# EasyEDA Pro project ProDoc_Small size safemrc_2025-09-04.epro, schematic Schematic1_1

## Sheets
1 STM32_core: Board Name: Small size safemrc; Create Date: 2025-07-28; Page Name: STM32_core; Project Name: RMRB_with_current_sensor; Schematic Name: Schematic1_1; Update Date: 2025-09-03; Company: 嘉立创EDA; Page Size: A4; Version: V1.0
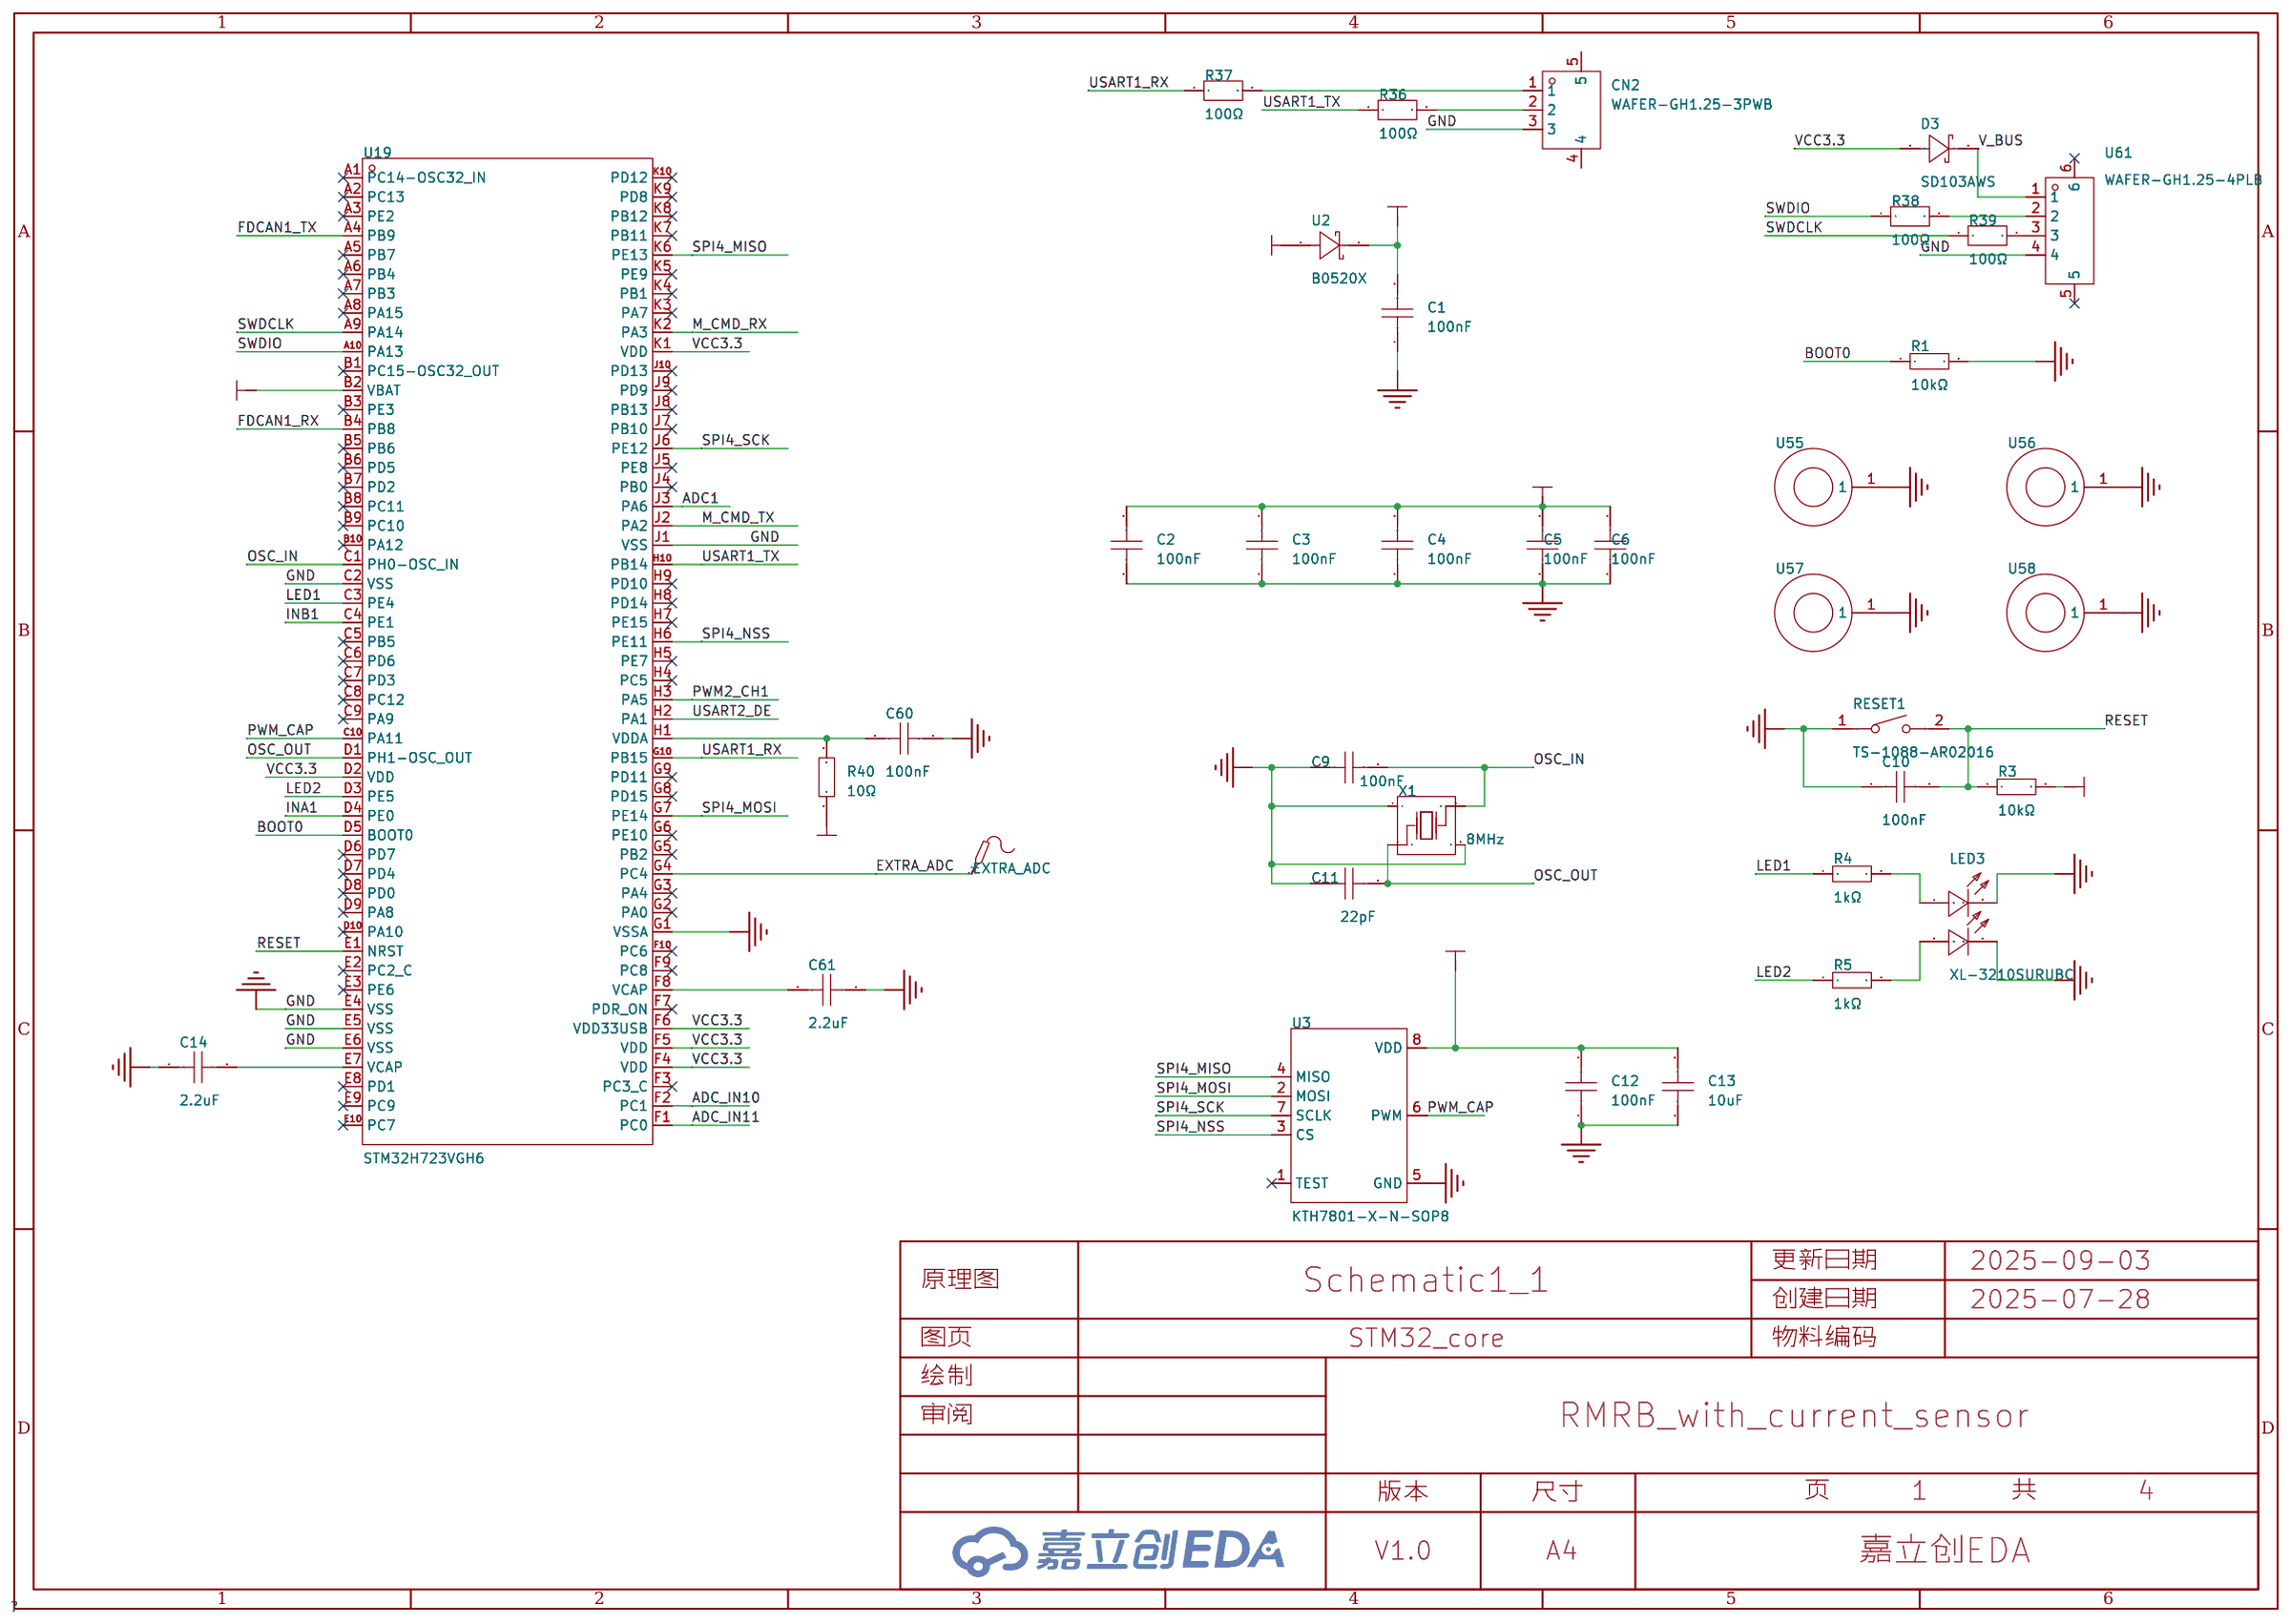
[diagram p0: STM32_core]
2 Power &amp; Com: Page Name: Power &amp; Com; Update Date: 2025-09-02
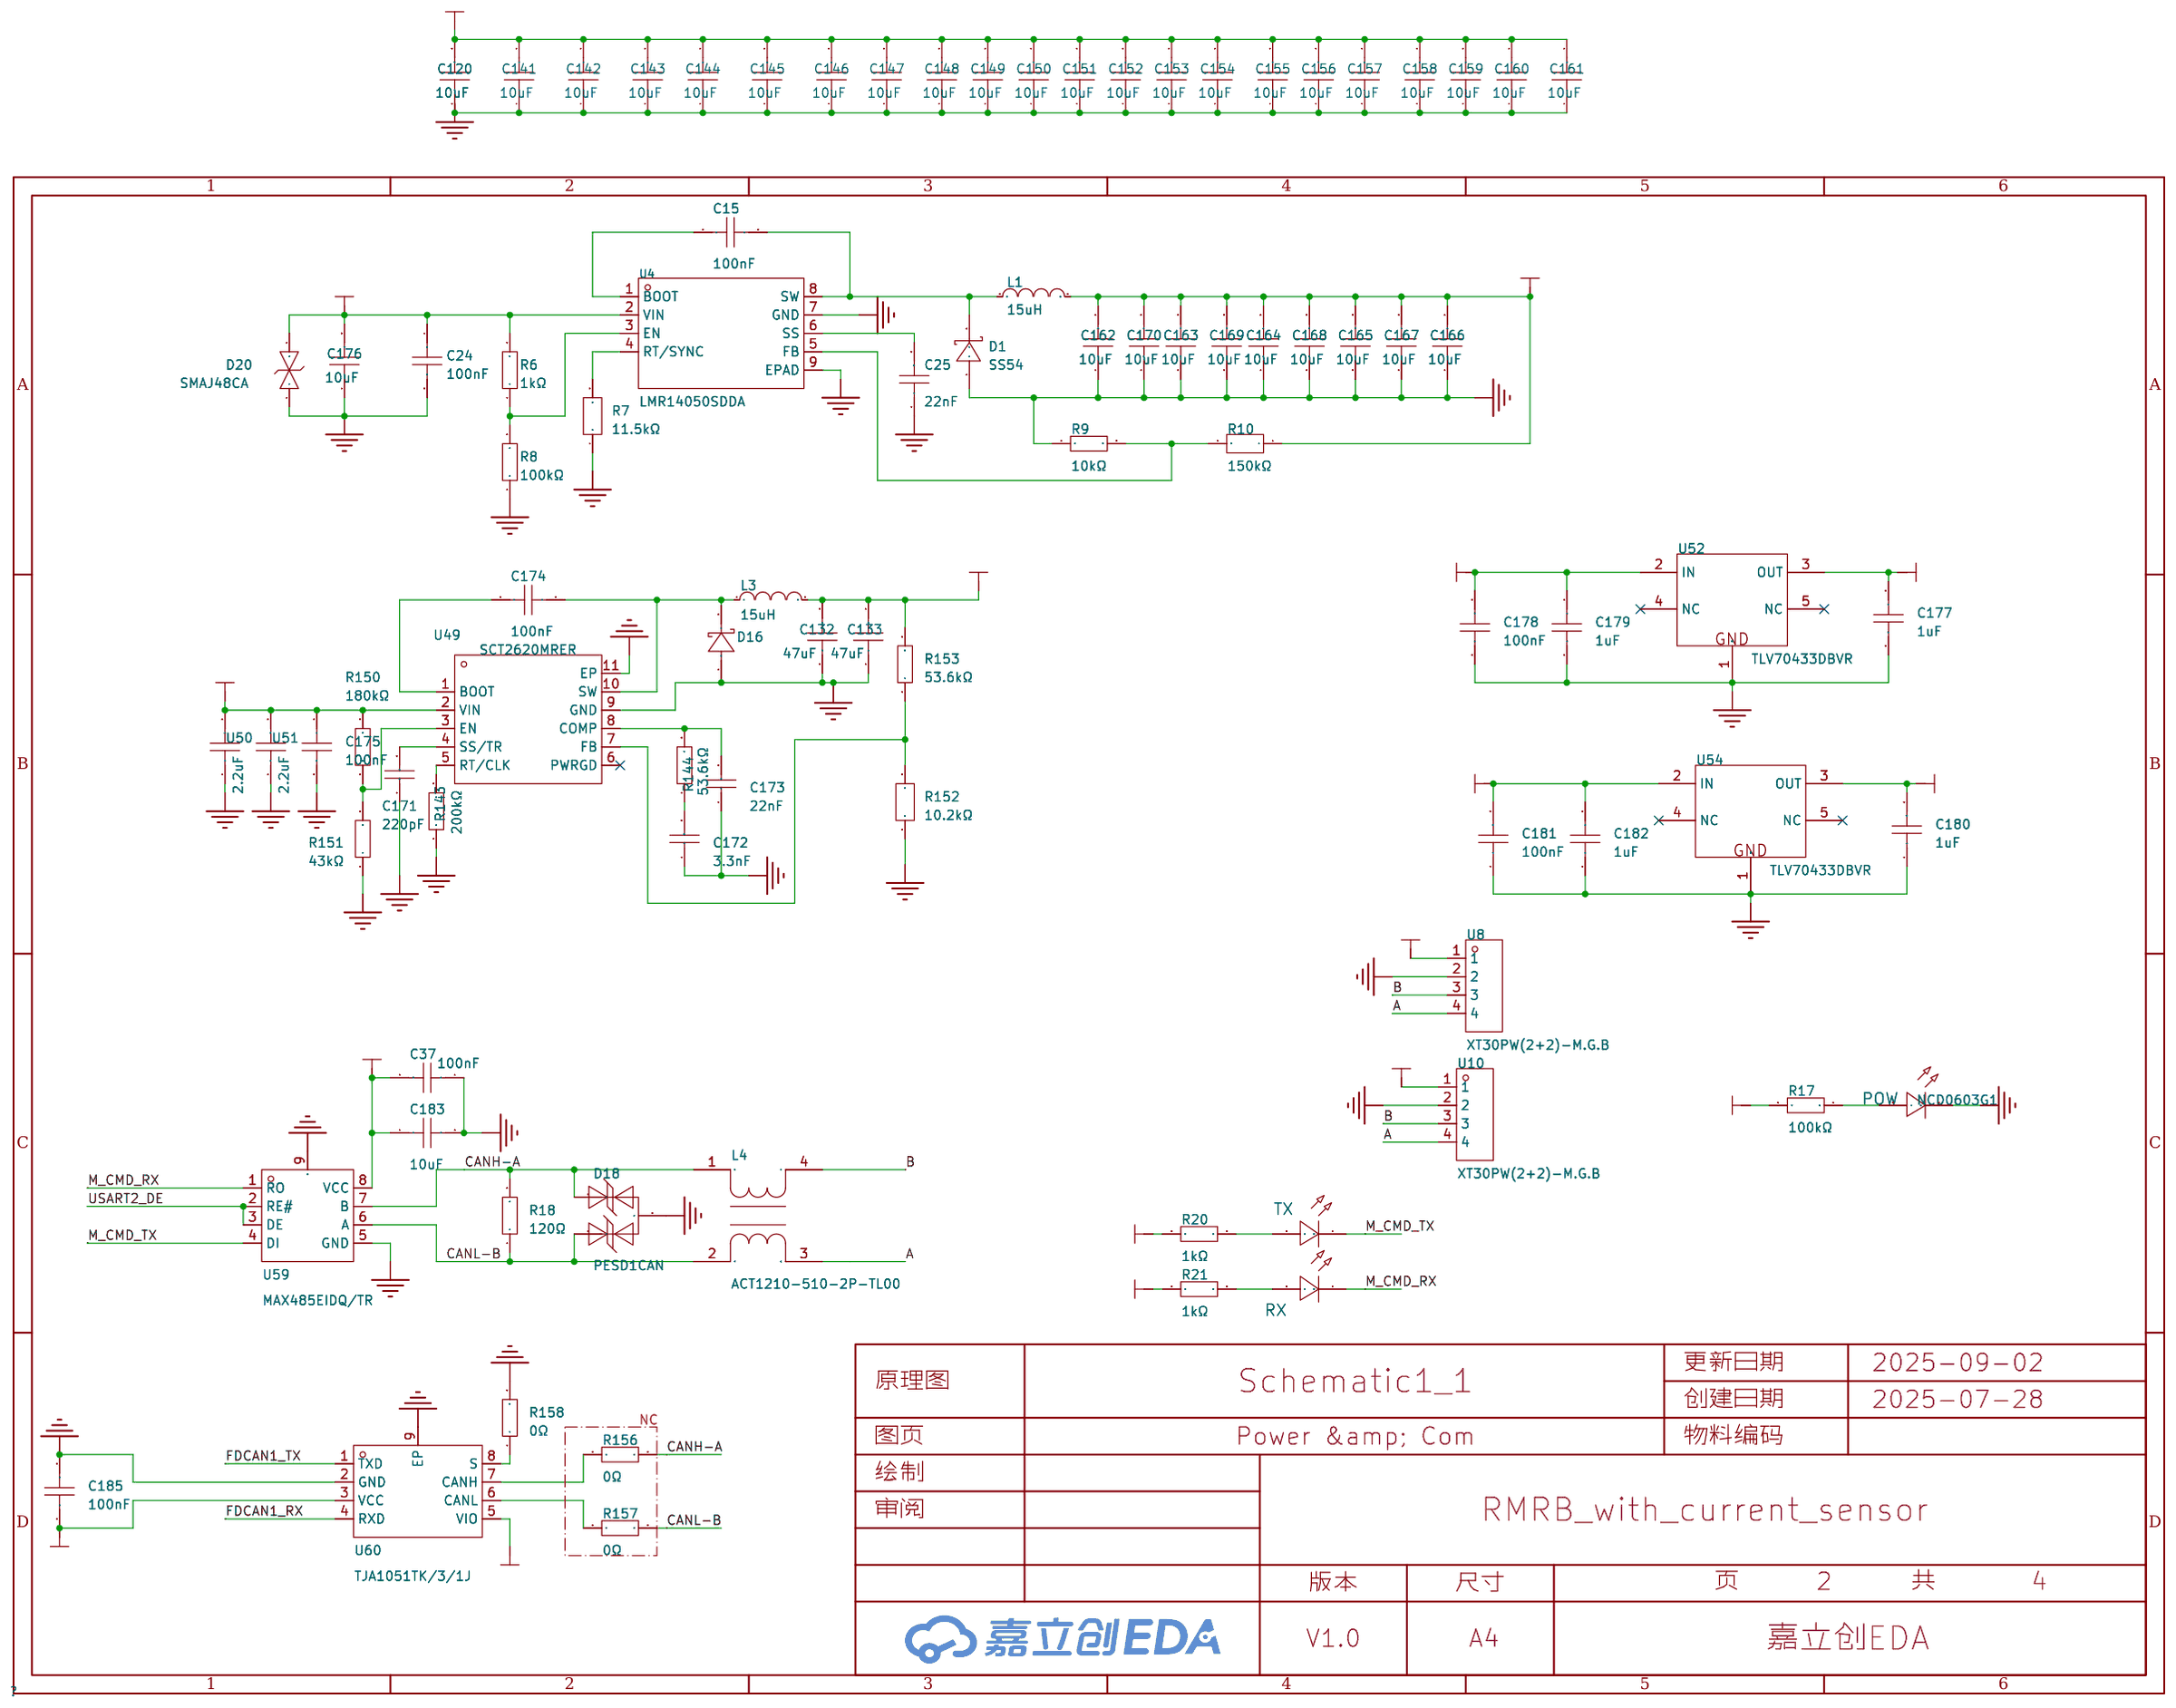
[diagram p1: Power &amp; Com]
3 H-bridge: Page Name: H-bridge; Update Date: 2025-08-11
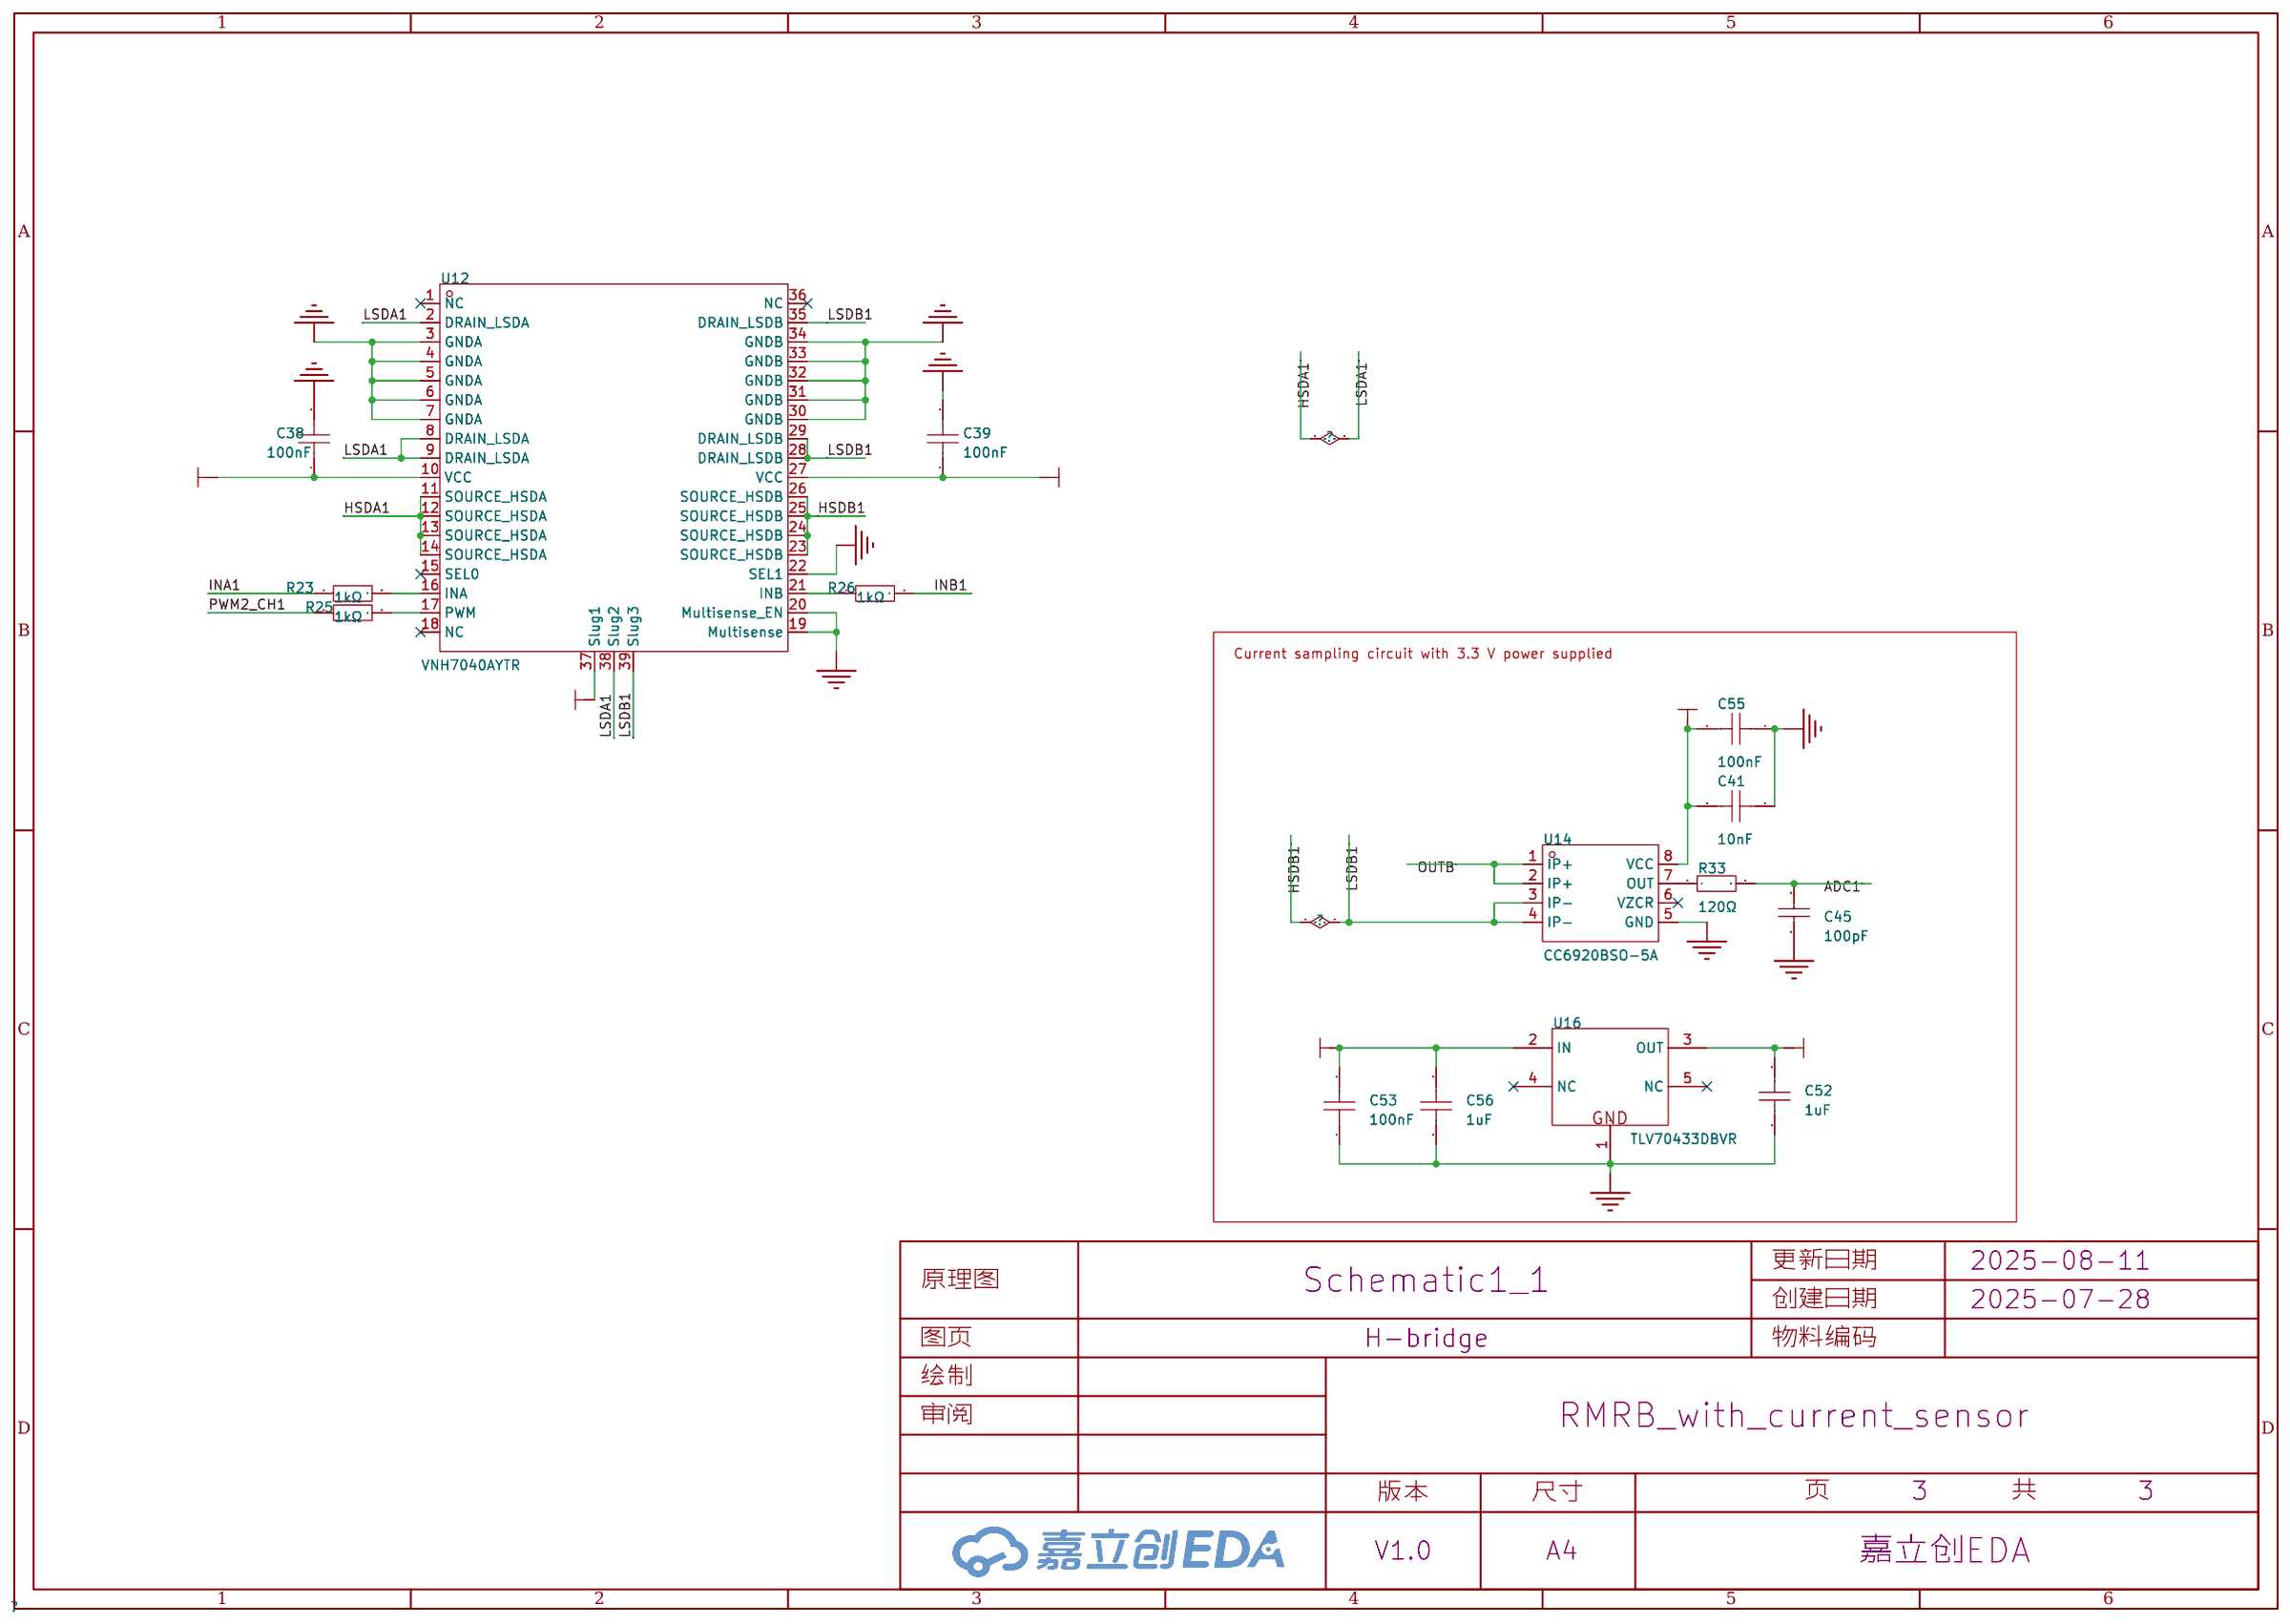
[diagram p2: H-bridge]
4 extensive adc: Create Date: 2025-09-03; Page Name: extensive adc
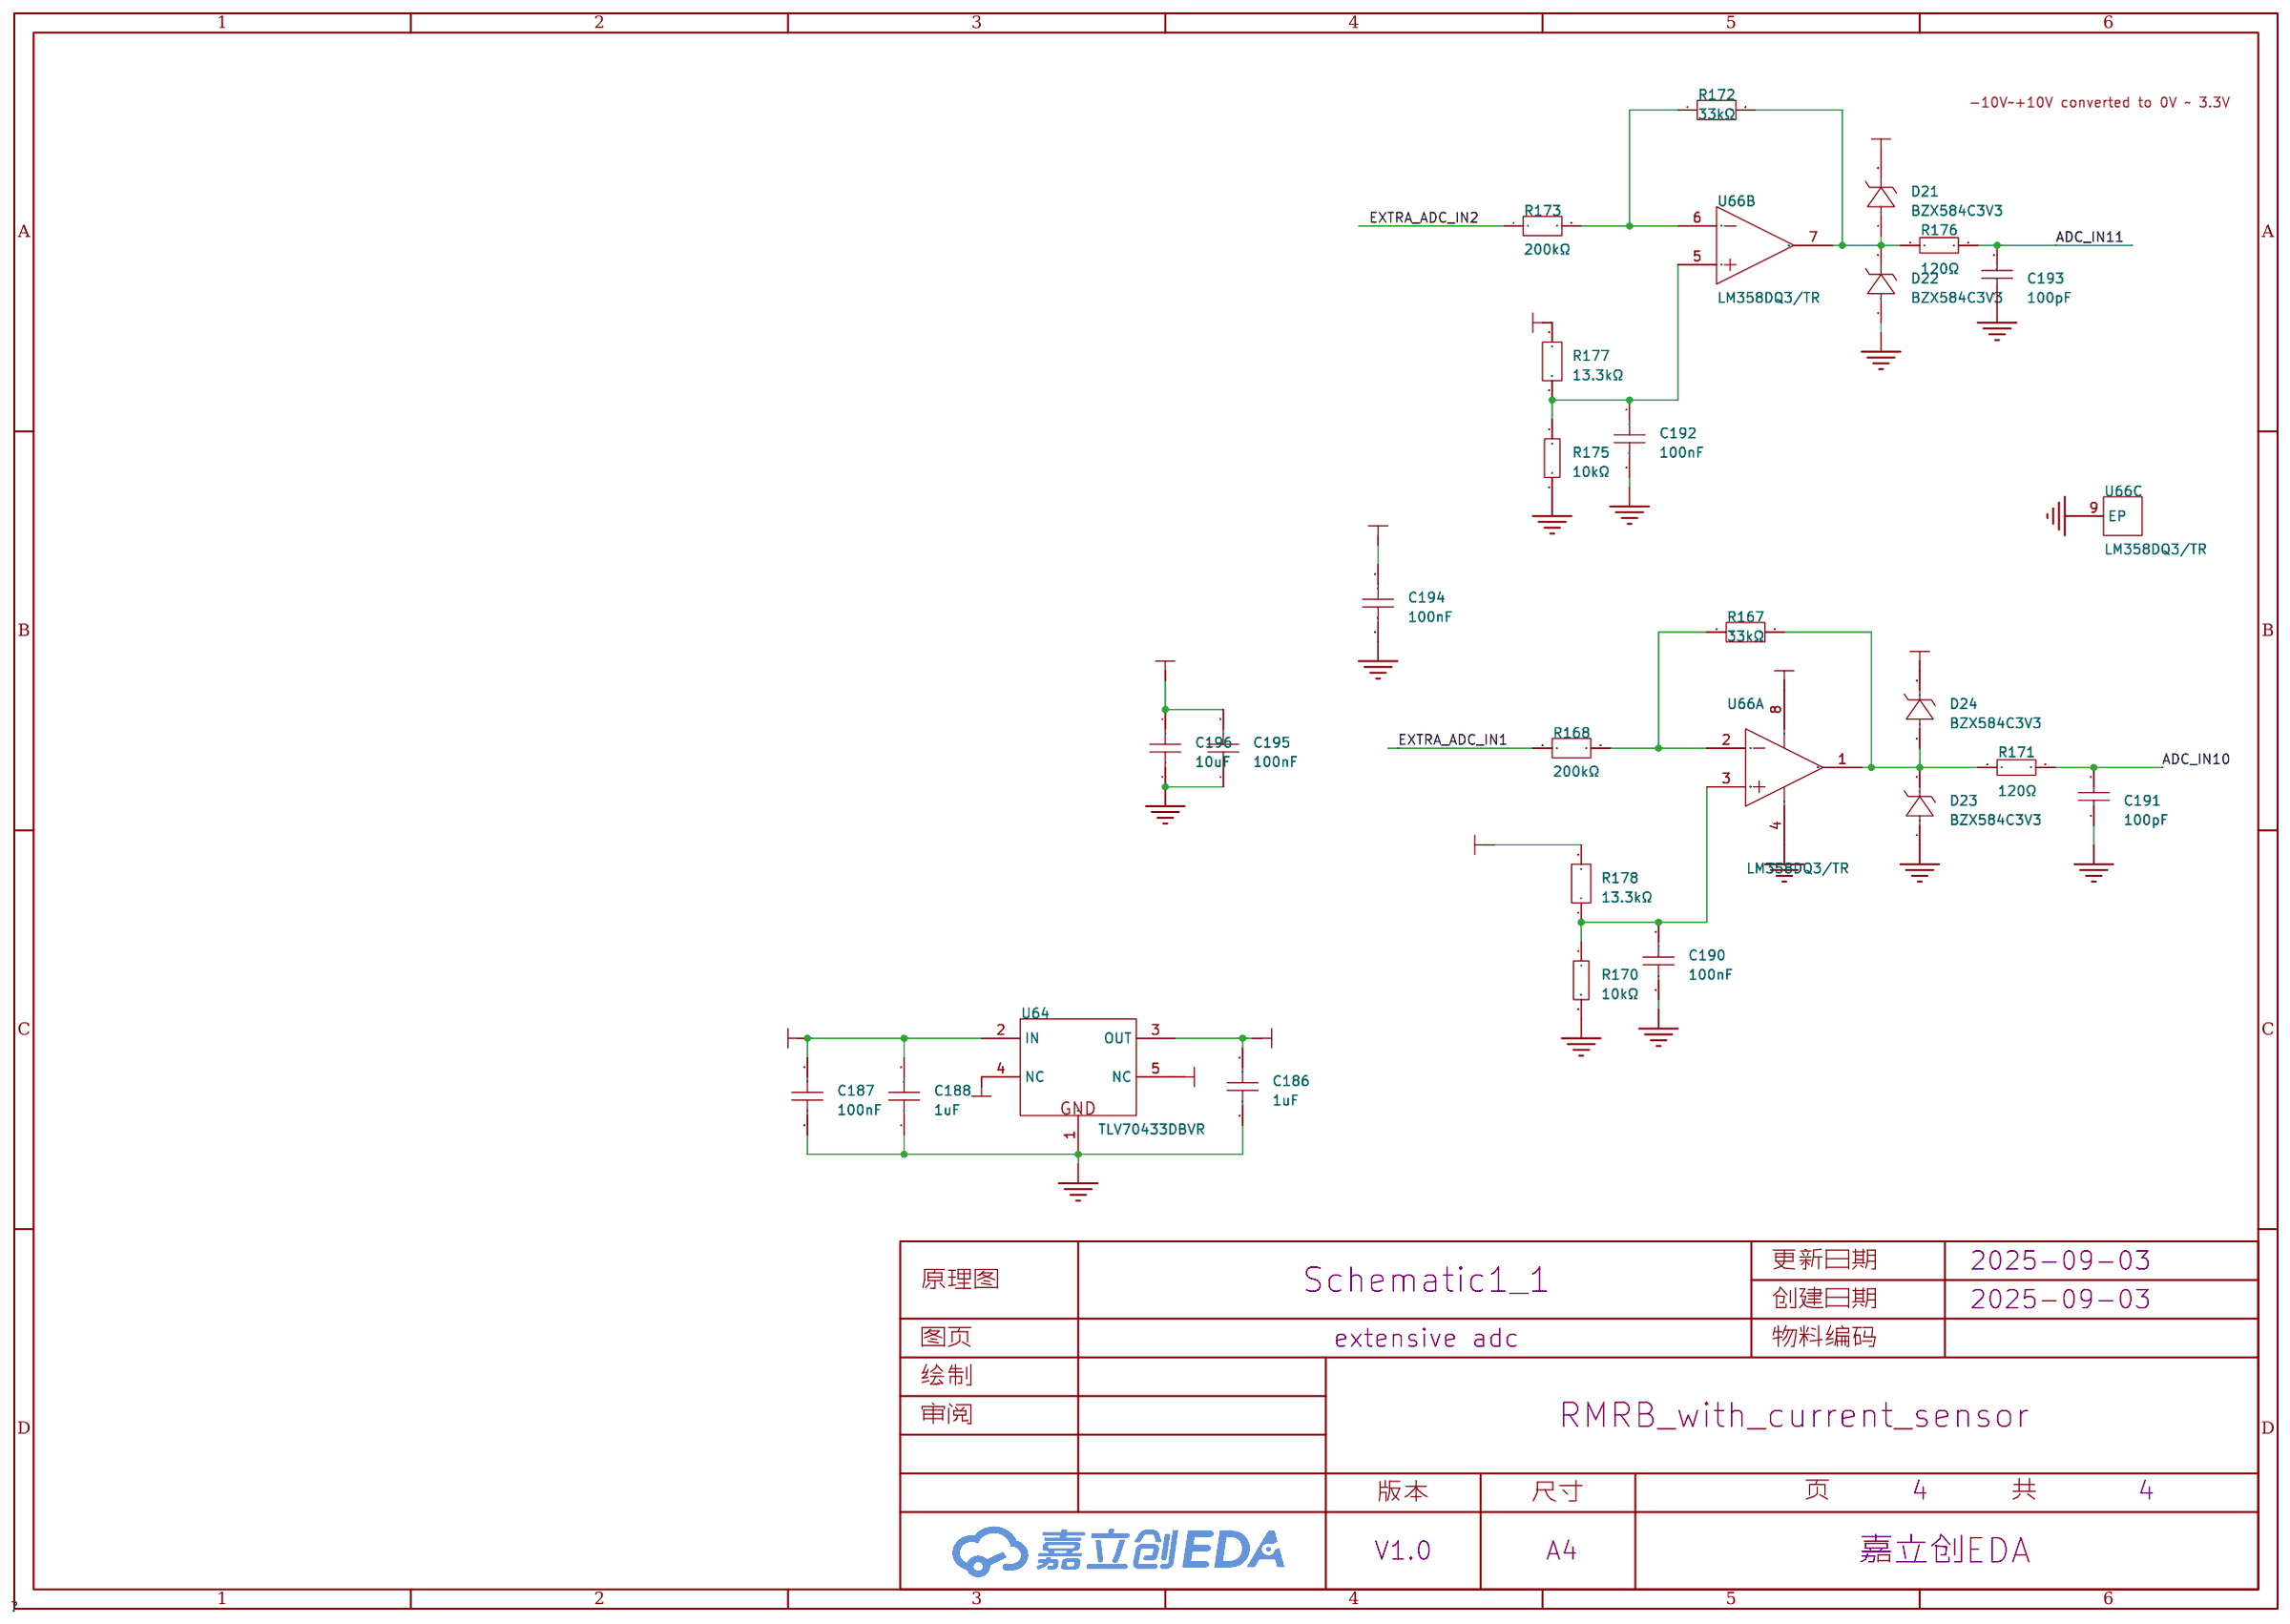
[diagram p3: extensive adc]

## Parts
sheet extensive adc
C186  1uF  [C0402]
C187  100nF  [C0402]
C188  1uF  [C0402]
C190  100nF  [C0402]
C191  100pF  [C0402]
C192  100nF  [C0402]
C193  100pF  [C0402]
C194  100nF  [C0402]
C195  100nF  [C0402]
C196  10uF  [C0402]
D21  BZX584C3V3  [SOD-523_L1.2-W0.8-LS1.6-FD]
D22  BZX584C3V3  [SOD-523_L1.2-W0.8-LS1.6-FD]
D23  BZX584C3V3  [SOD-523_L1.2-W0.8-LS1.6-FD]
D24  BZX584C3V3  [SOD-523_L1.2-W0.8-LS1.6-FD]
R167  33kΩ  [R0402]
R168  200kΩ  [R0402]
R170  10kΩ  [R0402]
R171  120Ω  [R0402]
R172  33kΩ  [R0402]
R173  200kΩ  [R0402]
R175  10kΩ  [R0402]
R176  120Ω  [R0402]
R177  13.3kΩ  [R0402]
R178  13.3kΩ  [R0402]
U64  TLV70433DBVR  [SOT-23-5_L3.0-W1.7-P0.95-LS2.8-BR]
U66  LM358DQ3/TR  [DFN-8_L3.0-W3.0-P0.65-BL-EP-2]  (sections 1,2,3)
sheet H-bridge
C38  100nF  [C0402]
C39  100nF  [C0402]
C41  10nF  [C0402]
C45  100pF  [C0402]
C52  1uF  [C0402]
C53  100nF  [C0402]
C55  100nF  [C0402]
C56  1uF  [C0402]
R23  1kΩ  [R0402]
R25  1kΩ  [R0402]
R26  1kΩ  [R0402]
R33  120Ω  [R0402]
U12  VNH7040AYTR  [POWERSSO-36_L10.3-W7.5-P0.50-LS10.3-BL-EP_VNH7070AYTR]
U14  CC6920BSO-5A  [SOP-8_L4.9-W3.9-P1.27-LS6.0-BL]
U16  TLV70433DBVR  [SOT-23-5_L3.0-W1.7-P0.95-LS2.8-BR]
sheet Power &amp; Com
C15  100nF  [C0402]
C24  100nF  [C0402]
C25  22nF  [C0402]
C37  100nF  [C0402]
C120  10uF  [C0805]
C132  47uF  [C0805]
C133  47uF  [C0805]
C141  10uF  [C0805]
C142  10uF  [C0805]
C143  10uF  [C0805]
C144  10uF  [C0805]
C145  10uF  [C0805]
C146  10uF  [C0805]
C147  10uF  [C0805]
C148  10uF  [C0805]
C149  10uF  [C0805]
C150  10uF  [C0805]
C151  10uF  [C0805]
C152  10uF  [C0805]
C153  10uF  [C0805]
C154  10uF  [C0805]
C155  10uF  [C0805]
C156  10uF  [C0805]
C157  10uF  [C0805]
C158  10uF  [C0805]
C159  10uF  [C0805]
C160  10uF  [C0805]
C161  10uF  [C0805]
C162  10uF  [C0805]
C163  10uF  [C0805]
C164  10uF  [C0805]
C165  10uF  [C0805]
C166  10uF  [C0805]
C167  10uF  [C0805]
C168  10uF  [C0805]
C169  10uF  [C0805]
C170  10uF  [C0805]
C171  220pF  [C0402]
C172  3.3nF  [C0402]
C173  22nF  [C0402]
C174  100nF  [C0402]
C175  100nF  [C0402]
C176  10uF  [C0805]
C177  1uF  [C0402]
C178  100nF  [C0402]
C179  1uF  [C0402]
C180  1uF  [C0402]
C181  100nF  [C0402]
C182  1uF  [C0402]
C183  10uF  [C0402]
C185  100nF  [C0201]
D1  SS54  [SMA_L4.4-W2.8-LS5.4-R-RD]
D16  B5819WS  [SOD-323_L1.7-W1.3-LS2.5-FD]
D18  PESD1CAN  [SOT-23-3_L2.9-W1.6-P1.90-LS2.8-BR]
D20  SMAJ48CA  [SMA_L4.4-W2.8-LS5.1-BI]
L1  15uH  [IND-SMD_L7.0-W6.6_FXL0630]
L3  15uH  [IND-SMD_L4.0-W4.0]
L4  ACT1210-510-2P-TL00  [FILTER-SMD_4P-L3.2-W2.5-BL_ACT1210]
POW  NCD0603G1  [LED0603-RD_1]
R6  1kΩ  [R0402]
R7  11.5kΩ  [R0402]
R8  100kΩ  [R0402]
R9  10kΩ  [R0402]
R10  150kΩ  [R0402]
R17  100kΩ  [R0402]
R18  120Ω  [R0402]
R20  1kΩ  [R0402]
R21  1kΩ  [R0402]
R143  200kΩ  [R0402]
R144  53.6kΩ  [R0402]
R150  180kΩ  [R0402]
R151  43kΩ  [R0402]
R152  10.2kΩ  [R0402]
R153  53.6kΩ  [R0402]
R156  0Ω  [R0402]
R157  0Ω  [R0402]
R158  0Ω  [R0402]
RX  NCD0603G1  [LED0603-RD_1]
TX  NCD0603G1  [LED0603-RD_1]
U4  LMR14050SDDA  [SOP-8_L4.9-W3.9-P1.27-LS6.0-BL-EP-2]
U8  XT30PW(2+2)-M.G.B  [CONN-TH_4P-XT30PW-M]
U10  XT30PW(2+2)-M.G.B  [CONN-TH_4P-XT30PW-M]
U49  SCT2620MRER  [MSOP-10_L3.0-W3.0-P0.50-LS5.0-BL-EP]
U50  2.2uF  [C0805]
U51  2.2uF  [C0805]
U52  TLV70433DBVR  [SOT-23-5_L3.0-W1.7-P0.95-LS2.8-BR]
U54  TLV70433DBVR  [SOT-23-5_L3.0-W1.7-P0.95-LS2.8-BR]
U59  MAX485EIDQ/TR  [DFN-8_L3.0-W3.0-P0.65-BL-EP2.45]
U60  TJA1051TK/3/1J  [HVSON-8_L3.0-W3.0-P0.65-BL-EP]
sheet STM32_core
C1  100nF  [C0402]
C2  100nF  [C0402]
C3  100nF  [C0402]
C4  100nF  [C0402]
C5  100nF  [C0402]
C6  100nF  [C0402]
C9  100nF  [C0402]
C10  100nF  [C0402]
C11  22pF  [C0402]
C12  100nF  [C0402]
C13  10uF  [C0603]
C14  2.2uF  [C0402]
C60  100nF  [C0402]
C61  2.2uF  [C0402]
CN2  WAFER-GH1.25-3PWB  [CONN-TH_3P-P1.25_GH1.25]
D3  SD103AWS  [SOD-323_L1.7-W1.3-LS2.6-RD-1]
EXTRA_ADC  -  [Test-Point-0.5mm]
LED3  XL-3210SURUBC  [LED-SMD_4P-L3.2-W1.5_LED_RGB]
R1  10kΩ  [R0402]
R3  10kΩ  [R0402]
R4  1kΩ  [R0402]
R5  1kΩ  [R0402]
R36  100Ω  [R0402]
R37  100Ω  [R0402]
R38  100Ω  [R0402]
R39  100Ω  [R0402]
R40  10Ω  [R0402]
RESET1  TS-1088-AR02016  [SW-SMD_L3.9-W3.0-P4.45]
U2  B0520X  [SOD-523_L1.2-W0.8-LS1.6-FD]
U3  KTH7801-X-N-SOP8  [SOIC-8_L4.9-W3.9-P1.27-LS6.0-BL]
U19  STM32H723VGH6  [TFBGA-100_L8.0-W8.0-R10-C10-P0.80-BL]
U55  -  [星月型焊盘]
U56  -  [星月型焊盘]
U57  -  [星月型焊盘]
U58  -  [星月型焊盘]
U61  WAFER-GH1.25-4PLB  [CONN-SMD_4P-P1.25_XUNPU_WAFER-GH1.25-4PLB]
X1  8MHz  [CRYSTAL-SMD_4P-L3.2-W2.5-BL]

## Library data of the parts
C52 C56 C177 C179 C180 C182 C186 C188 = CGA0402X5R105K500GT: 容值:1uF;精度:±10%;额定电压:50V;材质(温度系数):X5R;; LCSC Part Name: 1uF ±10% 50V; Supplier Part: C6119811; Manufacturer: HRE(芯声); Supplier Footprint: 0402; JLCPCB Part Class: 扩展库; Supplier: LCSC; Tolerance: ±10%; Voltage Rated: 50V; Temperature Coefficient: X5R
C53 C55 C178 C181 C187 C190 C192 C194 = CGA0402X7R104K160GT: 容值:100nF;精度:±10%;额定电压:16V;材质(温度系数):X7R;; LCSC Part Name: 100nF ±10% 16V; Supplier Part: C6119799; Manufacturer: HRE(芯声); Supplier Footprint: 0402; JLCPCB Part Class: 扩展库; Supplier: LCSC; Tolerance: ±10%; Voltage Rated: 16V; Temperature Coefficient: X7R
C45 C191 C193 = CC0402JRNPO9BN101: 容值:100pF;精度:±5%;额定电压:50V;材质(温度系数):NP0;; LCSC Part Name: 100pF ±5% 50V; Supplier Part: C106200; Manufacturer: YAGEO(国巨); Supplier Footprint: 0402; JLCPCB Part Class: Extended Part; Datasheet: https://atta.szlcsc.com/upload/public/pdf/source/20170505/1493957838062.pdf; Supplier: LCSC; Tolerance: ±5%; Voltage Rated: 50V; Temperature Coefficient: NP0
C1-C6 C9 C10 C12 C15 C24 C37-C39 C60 C174 C175 C195 = CC0402KRX7R9BB104: 容值:100nF;精度:±10%;额定电压:50V;材质(温度系数):X7R;; LCSC Part Name: 100nF ±10% 50V; Supplier Part: C131394; Manufacturer: YAGEO(国巨); Supplier Footprint: 0402; JLCPCB Part Class: Extended Part; Datasheet: https://atta.szlcsc.com/upload/public/pdf/source/20181008/C309510_22F155564471FAF6A489F7D68F34234E.pdf; Supplier: LCSC; Tolerance: ±10%; Voltage Rated: 50V; Temperature Coefficient: X7R
C183 C196 = CGA0402X5R106M100GT: 容值:10uF;精度:±20%;额定电压:10V;温度系数:X5R;; LCSC Part Name: 10uF ±20% 10V; Supplier Part: C6119763; Manufacturer: HRE(芯声); Supplier Footprint: 0402; JLCPCB Part Class: 扩展库; Supplier: LCSC; Tolerance: ±20%; Voltage Rating: 10V; Temperature Coefficient: X5R
D21-D24 = BZX584C3V3_C19077462: 二极管配置:独立式;稳压值(标称值):3.3V;稳压值(范围):3.1V~3.5V;耗散功率(Pd):150mW;; LCSC Part Name: 独立式 耐压:3.3V 电流:5uA@1V; Supplier Part: C19077462; Manufacturer: 宏嘉诚; Supplier Footprint: SOD-523; JLCPCB Part Class: 扩展库; Datasheet: https://item.szlcsc.com/datasheet/BZX584C3V3/20275547.html; Supplier: LCSC; Diode Configuration: 独立式; Zener Voltage(Nom): 3.3V; Reverse Leakage Current (Ir): 5uA@1V; Zener Voltage(Range): 3.1V~3.5V; Pd - Power Dissipation: 150mW; Impedance(Zzt): 95Ω; Impedance(Zzk): 600Ω; Operating Junction Temperature Range: -55℃~+150℃
R167 R172 = RT0402BRD0733KL: 电阻类型:薄膜电阻;阻值:33kΩ;精度:±0.1%;功率:62.5mW;温度系数:±25ppm/℃;; LCSC Part Name: 薄膜电阻 33kΩ ±0.1% 62.5mW; Supplier Part: C728559; Manufacturer: YAGEO(国巨); Supplier Footprint: 0402; JLCPCB Part Class: 扩展库; Datasheet: https://atta.szlcsc.com/upload/public/pdf/source/20200814/C723483_9C38DBFE9BAEFED0FBB9716EAA9FF07C.pdf; Supplier: LCSC; Type: 薄膜电阻; Tolerance: ±0.1%; Power(Watts): 62.5mW; Temperature Coefficient: ±25ppm/℃; Operating Temperature: -55℃~+155℃
R168 R173 = RT0402BRD07200KL: 电阻类型:薄膜电阻;阻值:200kΩ;精度:±0.1%;功率:62.5mW;温度系数:±25ppm/℃;; LCSC Part Name: 薄膜电阻 200kΩ ±0.1% 62.5mW; Supplier Part: C728556; Manufacturer: YAGEO(国巨); Supplier Footprint: 0402; JLCPCB Part Class: 扩展库; Datasheet: https://item.szlcsc.com/datasheet/RT0402BRD07200KL/775871.html; Supplier: LCSC; Type: 薄膜电阻; Tolerance: ±0.1%; Power(Watts): 62.5mW; Temperature Coefficient: ±25ppm/℃; Operating Temperature: -55℃~+155℃
R1 R3 R9 R170 R175 = RT0402BRD0710KL: 电阻类型:薄膜电阻;阻值:10kΩ;精度:±0.1%;功率:62.5mW;最大工作电压:50V;温度系数:±25ppm/℃;; LCSC Part Name: 薄膜电阻 10kΩ ±0.1% 62.5mW; Supplier Part: C190095; Manufacturer: YAGEO(国巨); Supplier Footprint: 0402; JLCPCB Part Class: Extended Part; Datasheet: https://atta.szlcsc.com/upload/public/pdf/source/20181009/C309664_C7CEF5A7F4D0541F96EF5E54D941D229.pdf; Supplier: LCSC; Type: 薄膜电阻; Tolerance: ±0.1%; Power(Watts): 62.5mW; Overload Voltage (Max): 50V; Temperature Coefficient: ±25ppm/℃; Operating Temperature Range: -55℃~+155℃
R18 R33 R171 R176 = 0402WGF1200TCE: 电阻类型:厚膜电阻;阻值:120Ω;精度:±1%;功率:62.5mW;最大工作电压:50V;温度系数:±100ppm/℃;; LCSC Part Name: 120Ω ±1% 62.5mW 厚膜电阻; Supplier Part: C25079; Manufacturer: UNI-ROYAL(厚声); Supplier Footprint: 0402; JLCPCB Part Class: Basic Part; Datasheet: https://atta.szlcsc.com/upload/public/pdf/source/20200306/C422600_1E6D84923E4A46A82E41ADD87F860B5C.pdf; Supplier: LCSC; Type: 厚膜电阻; Tolerance: ±1%; Power(Watts): 62.5mW; Overload Voltage (Max): 50V; Temperature Coefficient: ±100ppm/℃; Operating Temperature Range: -55℃~+155℃
R177 R178 = RT0402BRD0713K3L: 电阻类型:薄膜电阻;阻值:13.3kΩ;精度:±0.1%;功率:63mW;温度系数:±25ppm/℃;; LCSC Part Name: 薄膜电阻 13.3kΩ ±0.1% 63mW; Supplier Part: C852521; Manufacturer: YAGEO(国巨); Supplier Footprint: 0402; JLCPCB Part Class: 扩展库; Datasheet: https://atta.szlcsc.com/upload/public/pdf/source/20250609/0E6D5617EADA80FA3B707391883DF2D5.pdf; Supplier: LCSC; Type: 薄膜电阻; Tolerance: ±0.1%; Power(Watts): 63mW; Temperature Coefficient: ±25ppm/℃; Operating Temperature: -55℃~+155℃
U16 U52 U54 U64 = TLV70433DBVR: 输出类型:固定;最大输入电压:24V;输出电压:3.3V;输出电流:150mA;电源纹波抑制比(PSRR):60dB@(100kHz);输出极性:正极;; LCSC Part Name: 150mA、24V、超低 IQ、低压降稳压器; Supplier Part: C94917; Manufacturer: TI(德州仪器); Supplier Footprint: SOT-23-5; JLCPCB Part Class: 扩展库; Datasheet: https://www.ti.com/cn/lit/gpn/tlv704; Supplier: LCSC; Output Type: 固定; Maximum Input Voltage: 24V; Output Voltage: 3.3V; Output Current: 150mA; Power Supply Rejection Ratio (PSRR): 60dB@(100kHz); Dropout Voltage: 1.1V@(100mA); standby current: 4.5uA; Feature: 防静电保护；过流保护(OCP)；带使能；防倒灌; Operating Temperature: -40℃~+125℃@(Tj); Output Polarity: 正极; Number of Outputs: 1
U66 = LM358DQ3/TR: 放大器数:双路;增益带宽积(GBP):1.2MHz;输入失调电压(Vos):3mV;输入偏置电流(Ib):50nA;; LCSC Part Name: 双路低功耗差分式运算放大器，单/双电源供电; Supplier Part: C46635753; Manufacturer: HGSEMI(华冠); Supplier Footprint: DFN-8-EP(3x3); Datasheet: https://item.szlcsc.com/datasheet/LM358DQ3%252FTR/48791623.html; Supplier: LCSC; Number of Channels: 双路; Maximum Power Supply Range (Vdd-Vss): 36V; Gain Bandwidth Product: 1.2MHz; Vos - Input Offset Voltage: 3mV; Ib - Input Bias Current: 50nA; Input Offset Current(Ios): 50nA; Common Mode Rejection Ratio(CMRR): 80dB; Quiescent Current: 500uA; Output Current: 24mA; Operating Temperature: 0℃~+70℃; Single supply: 3V~36V; Dual Supply: -18V~18V
C41 = CC0402KRX7R9BB103: 容值:10nF;精度:±10%;额定电压:50V;材质(温度系数):X7R;; LCSC Part Name: 10nF ±10% 50V; Supplier Part: C60133; Manufacturer: YAGEO(国巨); Supplier Footprint: 0402; JLCPCB Part Class: Extended Part; Datasheet: https://atta.szlcsc.com/upload/public/pdf/source/20180224/C181747_15194369449651363981.pdf; Supplier: LCSC; Tolerance: ±10%; Voltage Rated: 50V; Temperature Coefficient: X7R
R4-R6 R20 R21 R23 R25 R26 = 0402WGF1001TCE: 电阻类型:厚膜电阻;阻值:1kΩ;精度:±1%;功率:62.5mW;最大工作电压:50V;温度系数:±100ppm/℃;; LCSC Part Name: 1kΩ ±1% 62.5mW 厚膜电阻; Supplier Part: C11702; Manufacturer: UNI-ROYAL(厚声); Supplier Footprint: 0402; JLCPCB Part Class: Basic Part; Datasheet: https://atta.szlcsc.com/upload/public/pdf/source/20200306/C422600_1E6D84923E4A46A82E41ADD87F860B5C.pdf; Supplier: LCSC; Type: 厚膜电阻; Tolerance: ±1%; Power(Watts): 62.5mW; Overload Voltage (Max): 50V; Temperature Coefficient: ±100ppm/℃; Operating Temperature Range: -55℃~+155℃
U12 = VNH7040AYTR: 汽车级全集成H桥电机驱动; Supplier Part: C2969764; Manufacturer: ST(意法半导体); Supplier Footprint: BFSOP-36-Power; Datasheet: https://atta.szlcsc.com/upload/public/pdf/source/20230906/FCBD933B3874E79041B74CBFD9E65DE7.pdf; Supplier: LCSC
U14 = CC6920BSO-5A: 电流测量范围:-5A~5A;隔离耐压:3500Vrms;灵敏度:264mV/A;; Supplier Part: C2880430; Manufacturer: CrossChip(成都芯进); Supplier Footprint: SOP-8; JLCPCB Part Class: 扩展库; Datasheet: https://atta.szlcsc.com/upload/public/pdf/source/20241128/C0E6ECA7AE7321445B7BA60B45AD2C20.pdf; Supplier: LCSC; Current Range: -5A~5A; Supply Voltage: 3.3V; Isolated Voltage Withstand: 3500Vrms; Sensitivity: 264mV/A; Standby Current: 20mA; Operating Temperature: -40℃~+125℃
C25 C173 = CC0402KRX7R9BB223: 容值:22nF;精度:±10%;额定电压:50V;材质(温度系数):X7R;; LCSC Part Name: 22nF ±10% 50V; Supplier Part: C107026; Manufacturer: YAGEO(国巨); Supplier Footprint: 0402; JLCPCB Part Class: Extended Part; Datasheet: https://atta.szlcsc.com/upload/public/pdf/source/20170914/C128857_1505359892143968080.pdf; Supplier: LCSC; Tolerance: ±10%; Voltage Rated: 50V; Temperature Coefficient: X7R
C120 C141-C170 C176 = GRM21BR61H106KE43L: 容值:10uF;精度:±10%;额定电压:50V;材质(温度系数):X5R;; LCSC Part Name: 10uF ±10% 50V; Supplier Part: C440198; Manufacturer: muRata(村田); Supplier Footprint: 0805; JLCPCB Part Class: 基础库; Datasheet: https://atta.szlcsc.com/upload/public/pdf/source/20230811/95AAE0C9AF55EDC31B7A4D8B733F534E.pdf; Supplier: LCSC; Tolerance: ±10%; Voltage Rated: 50V; Temperature Coefficient: X5R
C132 C133 = CGA0805X5R476M100MT: 容值:47uF;精度:±20%;额定电压:10V;材质(温度系数):X5R;; LCSC Part Name: 47uF ±20% 10V; Supplier Part: C6119904; Manufacturer: HRE(芯声); Supplier Footprint: 0805; JLCPCB Part Class: 扩展库; Supplier: LCSC; Tolerance: ±20%; Voltage Rated: 10V; Temperature Coefficient: X5R
C171 = CC0402JRNPO9BN221: 容值:220pF;精度:±5%;额定电压:50V;温度系数:NP0;; LCSC Part Name: 220pF ±5% 50V; Supplier Part: C107001; Manufacturer: YAGEO(国巨); Supplier Footprint: 0402; JLCPCB Part Class: 扩展库; Datasheet: https://item.szlcsc.com/datasheet/CC0402JRNPO9BN221/108217.html; Supplier: LCSC; Tolerance: ±5%; Voltage Rating: 50V; Temperature Coefficient: NP0
C172 = CC0402KRX7R9BB332: 容值:3.3nF;精度:±10%;额定电压:50V;材质(温度系数):X7R;; LCSC Part Name: 3.3nF ±10% 50V; Supplier Part: C107028; Manufacturer: YAGEO(国巨); Supplier Footprint: 0402; JLCPCB Part Class: 扩展库; Datasheet: https://atta.szlcsc.com/upload/public/pdf/source/20170914/C128857_1505359892143968080.pdf; Supplier: LCSC; Tolerance: ±10%; Voltage Rated: 50V; Temperature Coefficient: X7R
C185 = CC0201KRX5R8BB104: 容值:100nF;精度:±10%;额定电压:25V;材质(温度系数):X5R;; LCSC Part Name: 100nF ±10% 25V; Supplier Part: C718252; Manufacturer: YAGEO(国巨); Supplier Footprint: 0201; JLCPCB Part Class: 扩展库; Datasheet: https://atta.szlcsc.com/upload/public/pdf/source/20200804/C718252_F913CDC867BA9A57D11B79FB7329CCCF.pdf; Supplier: LCSC; Tolerance: ±10%; Voltage Rated: 25V; Temperature Coefficient: X5R
D1 = SS54_C22452: 二极管配置:独立式;正向压降(Vf):550mV@5A;直流反向耐压(Vr):40V;整流电流:5A;; LCSC Part Name: 电压:40V 电流:5A; Supplier Part: C22452; Manufacturer: MDD(辰达半导体); Supplier Footprint: SMA(DO-214AC); JLCPCB Part Class: Basic Part; Datasheet: https://atta.szlcsc.com/upload/public/pdf/source/20240710/73DFBB65C1883B895E62D589679033DF.pdf; Supplier: LCSC; Forward Voltage (Vf@If): 550mV@5A; Reverse Voltage (Vr): 40V; Average Rectified Current (Io): 5A; Reverse Leakage Current (Ir): 1mA@40V; Diode Configuration: 独立式; Rectified Current: 5A
D16 = B5819WS_C7420331: 二极管配置:独立式;正向压降(Vf):600mV@1.0A;直流反向耐压(Vr):40V;平均整流电流(Io):1A;; LCSC Part Name: 电压:40V 电流:1A; Supplier Part: C7420331; Manufacturer: 宏迦橙; Supplier Footprint: SOD-323; JLCPCB Part Class: 扩展库; Datasheet: https://atta.szlcsc.com/upload/public/pdf/source/20230828/03CA0F4F90DAE368A7153B7B5E4D0651.pdf; Supplier: LCSC; Diode Configuration: 独立式; Forward Voltage (Vf@If): 600mV@1.0A; Reverse Voltage (Vr): 40V; Average Rectified Current (Io): 1A; Reverse Leakage Current (Ir): 1mA@40V; Peak forward surge current: 10A
D18 = PESD1CAN_C343993: 极性:双向;反向截止电压(Vrwm):24V;钳位电压:48V;峰值脉冲电流(Ipp):6A;击穿电压:26.7V;; LCSC Part Name: 双向ESD; Supplier Part: C343993; Manufacturer: BORN(伯恩半导体); Supplier Footprint: SOT-23; JLCPCB Part Class: 扩展库; Datasheet: https://atta.szlcsc.com/upload/public/pdf/source/20181211/C343993_AF595724ADB82F42A1C256C97FD7AD6B.pdf; Supplier: LCSC; Polarity: 双向; Reverse Stand-Off Voltage (Vrwm): 24V; Clamping Voltage: 48V; Peak Pulse Current (Ipp): 6A; Voltage - Breakdown: 26.7V; Type: ESD
D20 = SMAJ48CA_C2922198: 极性:双向;反向截止电压(Vrwm):48V;钳位电压:77.4V;峰值脉冲电流(Ipp):5.2A;峰值脉冲功率(Ppp):400W;击穿电压:53.3V;; LCSC Part Name: 双向TVS 48V截止 77.4A峰值脉冲; Supplier Part: C2922198; Manufacturer: GOODWORK(固得沃克); Supplier Footprint: DO-214AC(SMA); JLCPCB Part Class: 扩展库; Datasheet: https://item.szlcsc.com/datasheet/SMAJ48CA/3231160.html; Supplier: LCSC; Polarity: 双向; Reverse Stand-Off Voltage (Vrwm): 48V; Clamping Voltage: 77.4V; Peak Pulse Current (Ipp): 5.2A; Peak Pulse Power Dissipation (Ppp): 400W; Voltage - Breakdown: 53.3V; Reverse Leakage Current (Ir): 5uA; Operating Temperature: -55℃~+150℃@(Tj); Type: TVS
L1 = FXL0630-150-M: 电感值:15uH;精度:±20%;额定电流:3A;饱和电流(Isat):4.5A;类型:一体成型电感;; LCSC Part Name: 15uH ±20% 4.5A; Supplier Part: C177243; Manufacturer: cjiang(长江微电); Supplier Footprint: SMD,6.6x7mm; Datasheet: https://atta.szlcsc.com/upload/public/pdf/source/20240426/3189EA8206330E2108542F9E34E540E7.pdf; Supplier: LCSC; Tolerance: ±20%; Rated Current: 3A; Saturation Current (Isat): 4.5A; DC Resistance (DCR): 115mΩ; Type: 一体成型电感
L3 = FHD4020S-150MT: 电感值:15uH;精度:±20%;额定电流:1.2A;饱和电流(Isat):2.8A;类型:绕线电感;; LCSC Part Name: 15uH ±20% 2.8A; Supplier Part: C602033; Manufacturer: cjiang(长江微电); Supplier Footprint: SMD,4x4mm; JLCPCB Part Class: 扩展库; Datasheet: https://atta.szlcsc.com/upload/public/pdf/source/20200609/C601990_BCEA243EC4DA0A9A288AA78A6DFB48A5.pdf; Supplier: LCSC; Tolerance: ±20%; Current Rating: 1.2A; Current - Saturation(Isat): 2.8A; DC Resistance(DCR): 305mΩ; Type: 绕线电感
L4 = ACT1210-510-2P-TL00: 通道数:2;电感@频率:51uH@100kHz;阻抗@频率:2.6kΩ@10MHz;直流电阻(DCR):700mΩ;; LCSC Part Name: 两路 共模滤波器 阻抗2.6kΩ@10MHz; Supplier Part: C95572; Manufacturer: TDK; Supplier Footprint: SMD-4P,3.2x2.5mm; Datasheet: https://item.szlcsc.com/datasheet/ACT1210-510-2P-TL00/96776.html; Supplier: LCSC; Number of Lines: 2; Current Rating: 200mA; Inductance @ Frequency: 51uH@100kHz; Voltage Rating - DC: 80V; Impedance @ Frequency: 2.6kΩ@10MHz; DC Resistance(DCR): 700mΩ; Operating Temperature: -55℃~+150℃
POW RX TX = NCD0603G1: 发光颜色:翠绿色;正向电压(VF):2.6V~3.6V;功率:72mW;正向电流:10mA;主波长:515nm~530nm;透镜颜色:无色透明透镜;发光强度:330mcd~900mcd;发光角度:130°;工作温度:-30℃~+85℃;; Supplier Part: C84267; Manufacturer: 国星光电; Supplier Footprint: 0603; JLCPCB Part Class: Extended Part; Datasheet: https://atta.szlcsc.com/upload/public/pdf/source/20200820/C84267_04BA7703640BAC111D09F5EFB971FBF3.pdf; Supplier: LCSC; Emitted Color: 翠绿色; Forward Voltage (VF): 2.6V~3.6V; Power Dissipation: 72mW; Forward Current: 10mA; Dominant Wavelength: 515nm~530nm; Lens Color: 无色透明透镜; Luminous Intensity: 330mcd~900mcd; Viewing Angle: 130°; Operating Temperature: -30℃~+85℃
R7 = 0402WGF1152TCE: 电阻类型:厚膜电阻;阻值:11.5kΩ;精度:±1%;功率:62.5mW;最大工作电压:50V;温度系数:±100ppm/℃;; LCSC Part Name: 11.5kΩ ±1% 62.5mW 厚膜电阻; Supplier Part: C270653; Manufacturer: UNI-ROYAL(厚声); Supplier Footprint: 0402; JLCPCB Part Class: Extended Part; Datasheet: https://atta.szlcsc.com/upload/public/pdf/source/20200306/C422600_1E6D84923E4A46A82E41ADD87F860B5C.pdf; Supplier: LCSC; Type: 厚膜电阻; Tolerance: ±1%; Power(Watts): 62.5mW; Overload Voltage (Max): 50V; Temperature Coefficient: ±100ppm/℃; Operating Temperature Range: -55℃~+155℃
R8 R17 = RT0402BRD07100KL: 电阻类型:薄膜电阻;阻值:100kΩ;精度:±0.1%;功率:62.5mW;最大工作电压:50V;温度系数:±25ppm/℃;; LCSC Part Name: 薄膜电阻 100kΩ ±0.1% 62.5mW; Supplier Part: C852472; Manufacturer: YAGEO(国巨); Supplier Footprint: 0402; JLCPCB Part Class: Extended Part; Datasheet: https://atta.szlcsc.com/upload/public/pdf/source/20210326/C852472_6283D268A9C33EA67274729CC55E28B1.pdf; Supplier: LCSC; Type: 薄膜电阻; Tolerance: ±0.1%; Power(Watts): 62.5mW; Overload Voltage (Max): 50V; Temperature Coefficient: ±25ppm/℃; Operating Temperature Range: -55℃~+155℃
R10 = RT0402BRD07150KL: 电阻类型:薄膜电阻;阻值:150kΩ;精度:±0.1%;功率:63mW;温度系数:±25ppm/℃;; LCSC Part Name: 薄膜电阻 150kΩ ±0.1% 63mW; Supplier Part: C852538; Manufacturer: YAGEO(国巨); Supplier Footprint: 0402; JLCPCB Part Class: Extended Part; Datasheet: https://atta.szlcsc.com/upload/public/pdf/source/20200610/C326738_5639A9F1B6EB6E4AE2197577D3456E7F.pdf; Supplier: LCSC; Type: 薄膜电阻; Tolerance: ±0.1%; Power(Watts): 63mW; Temperature Coefficient: ±25ppm/℃; Operating Temperature: -55℃~+155℃
R143 = 0402WGF2003TCE: 电阻类型:厚膜电阻;阻值:200kΩ;精度:±1%;功率:62.5mW;最大工作电压:50V;温度系数:±100ppm/℃;; LCSC Part Name: 200kΩ ±1% 62.5mW 厚膜电阻; Supplier Part: C25764; Manufacturer: UNI-ROYAL(厚声); Supplier Footprint: 0402; JLCPCB Part Class: 基础库; Datasheet: https://atta.szlcsc.com/upload/public/pdf/source/20200306/C422600_1E6D84923E4A46A82E41ADD87F860B5C.pdf; Supplier: LCSC; Type: 厚膜电阻; Tolerance: ±1%; Power(Watts): 62.5mW; Overload Voltage (Max): 50V; Temperature Coefficient: ±100ppm/℃; Operating Temperature Range: -55℃~+155℃
R144 = 0402WGF5362TCE: 电阻类型:厚膜电阻;阻值:53.6kΩ;精度:±1%;功率:62.5mW;最大工作电压:50V;温度系数:±100ppm/℃;; LCSC Part Name: 53.6kΩ ±1% 62.5mW 厚膜电阻; Supplier Part: C53398; Manufacturer: UNI-ROYAL(厚声); Supplier Footprint: 0402; JLCPCB Part Class: 扩展库; Datasheet: https://atta.szlcsc.com/upload/public/pdf/source/20200306/C422600_1E6D84923E4A46A82E41ADD87F860B5C.pdf; Supplier: LCSC; Type: 厚膜电阻; Tolerance: ±1%; Power(Watts): 62.5mW; Overload Voltage (Max): 50V; Temperature Coefficient: ±100ppm/℃; Operating Temperature Range: -55℃~+155℃
R150 = 0402WGF1803TCE: 电阻类型:厚膜电阻;阻值:180kΩ;精度:±1%;功率:62.5mW;最大工作电压:50V;温度系数:±100ppm/℃;; LCSC Part Name: 180kΩ ±1% 62.5mW 厚膜电阻; Supplier Part: C25760; Manufacturer: UNI-ROYAL(厚声); Supplier Footprint: 0402; JLCPCB Part Class: 扩展库; Datasheet: https://atta.szlcsc.com/upload/public/pdf/source/20200306/C422600_1E6D84923E4A46A82E41ADD87F860B5C.pdf; Supplier: LCSC; Type: 厚膜电阻; Tolerance: ±1%; Power(Watts): 62.5mW; Overload Voltage (Max): 50V; Temperature Coefficient: ±100ppm/℃; Operating Temperature Range: -55℃~+155℃
R151 = 0402WGF4302TCE: 电阻类型:厚膜电阻;阻值:43kΩ;精度:±1%;功率:62.5mW;最大工作电压:50V;温度系数:±100ppm/℃;; LCSC Part Name: 43kΩ ±1% 62.5mW 厚膜电阻; Supplier Part: C8329; Manufacturer: UNI-ROYAL(厚声); Supplier Footprint: 0402; JLCPCB Part Class: 扩展库; Datasheet: https://atta.szlcsc.com/upload/public/pdf/source/20200306/C422600_1E6D84923E4A46A82E41ADD87F860B5C.pdf; Supplier: LCSC; Type: 厚膜电阻; Tolerance: ±1%; Power(Watts): 62.5mW; Overload Voltage (Max): 50V; Temperature Coefficient: ±100ppm/℃; Operating Temperature Range: -55℃~+155℃
R152 = RT0402BRD0710K2L: 电阻类型:薄膜电阻;阻值:10.2kΩ;精度:±0.1%;功率:62.5mW;工作电压:50V;温度系数:±25ppm/℃;; LCSC Part Name: 薄膜电阻 10.2kΩ ±0.1% 62.5mW; Supplier Part: C852479; Manufacturer: YAGEO(国巨); Supplier Footprint: 0402; JLCPCB Part Class: 扩展库; Datasheet: https://atta.szlcsc.com/upload/public/pdf/source/20210611/C862799_8912813F96AC1C7A73A34A8AA3FAC83D.pdf; Supplier: LCSC; Type: 薄膜电阻; Tolerance: ±0.1%; Power(Watts): 62.5mW; Voltage-Supply(Max): 50V; Temperature Coefficient: ±25ppm/℃; Operating Temperature: -55℃~+155℃
R153 = RC0402FR-0753K6L: 电阻类型:厚膜电阻;阻值:53.6kΩ;精度:±1%;功率:62.5mW;最大工作电压:50V;温度系数:±100ppm/℃;; LCSC Part Name: 厚膜电阻 53.6kΩ ±1% 62.5mW; Supplier Part: C273330; Manufacturer: YAGEO(国巨); Supplier Footprint: 0402; JLCPCB Part Class: 扩展库; Datasheet: https://atta.szlcsc.com/upload/public/pdf/source/20180904/C276339_014E484F1DBA106FB92D45EABD5A1AC1.pdf; Supplier: LCSC; Type: 厚膜电阻; Tolerance: ±1%; Power(Watts): 62.5mW; Overload Voltage (Max): 50V; Temperature Coefficient: ±100ppm/℃; Operating Temperature Range: -55℃~+155℃
R156-R158 = 0402WGF0000TCE: 电阻类型:厚膜电阻;阻值:0Ω;精度:±1%;功率:62.5mW;工作电压:50V;温度系数:±800ppm/℃;; LCSC Part Name: 0Ω ±1% 62.5mW 厚膜电阻; Supplier Part: C17168; Manufacturer: UNI-ROYAL(厚声); Supplier Footprint: 0402; JLCPCB Part Class: 基础库; Datasheet: https://item.szlcsc.com/datasheet/0402WGF0000TCE/17853.html; Supplier: LCSC; Type: 厚膜电阻; Tolerance: ±1%; Power(Watts): 62.5mW; Voltage-Supply(Max): 50V; Temperature Coefficient: ±800ppm/℃; Operating Temperature: -55℃~+155℃
U4 = LMR14050SDDA: 功能类型:降压型;输出类型:可调;输入电压:4V~40V;输出电压:800mV~28V;输出电流(最大值):5A;; Supplier Part: C98458; Manufacturer: TI(德州仪器); Supplier Footprint: SOP-8-EP; JLCPCB Part Class: 扩展库; Datasheet: https://www.ti.com/cn/lit/gpn/lmr14050; Supplier: LCSC; Function: 降压型; Synchronous Rectification: 否; Output Type: 可调; Number of Outputs: 1; Topology: 降压式; Input Voltage: 4V~40V; Output Voltage: 800mV~28V; Output Current (Max): 5A; Switching Frequency: 2.5MHz; Operating Temperature: -40℃~+125℃@(TJ)
U8 U10 = XT30(2+2)PW-M.G.B: LCSC Part Name: XT30PW(2+2)功率数据混合插头公金黑PCB弯插; Supplier Part: C19268030; Manufacturer: AMASS(艾迈斯); JLCPCB Part Class: Extended Part; Datasheet: https://atta.szlcsc.com/upload/public/pdf/source/20240112/A815AE62CB016131F8636555ECBDABF7.pdf; Supplier: LCSC
U49 = SCT2620MRER: Supplier Part: C2912566; Manufacturer: SCT(芯洲科技); Supplier Footprint: MSOP-10-EP; JLCPCB Part Class: 扩展库; Datasheet: https://atta.szlcsc.com/upload/public/pdf/source/20211112/32605C070F5603B6DC83939058DE471B.pdf; Supplier: LCSC
U50 U51 = CGA0805X7R225K101MT: 容值:2.2uF;精度:±10%;额定电压:100V;材质(温度系数):X7R;; LCSC Part Name: 2.2uF ±10% 100V; Supplier Part: C6119935; Manufacturer: HRE(芯声); Supplier Footprint: 0805; JLCPCB Part Class: 扩展库; Datasheet: https://atta.szlcsc.com/upload/public/pdf/source/20240429/FFBBB2C1A6FCA7F2201C7203CC19BC42.pdf; Supplier: LCSC; Tolerance: ±10%; Voltage Rated: 100V; Temperature Coefficient: X7R
U59 = MAX485EIDQ/TR: 类型:收发器;数据速率:10Mbps;; Supplier Part: C20613239; Manufacturer: HGSEMI(华冠); Supplier Footprint: DFN-8(3x3); JLCPCB Part Class: 扩展库; Datasheet: https://item.szlcsc.com/datasheet/MAX485EIDQ%252FTR/21973983.html; Supplier: LCSC; Type: 收发器; Number of Drivers: 1; Number of Receivers: 1; Voltage - Supply: 4.5V~5.5V; Data Rate: 10Mbps; ESD Protect: ±16kV; Operating Temperature: -40℃~+85℃
U60 = TJA1051TK/3/1J: 类型:CAN收发器;数据速率:5Mbps;; Supplier Part: C2875699; Manufacturer: NXP(恩智浦); Supplier Footprint: HVSON-8-EP(3x3); JLCPCB Part Class: 扩展库; Datasheet: https://www.nxp.com/docs/en/data-sheet/TJA1051.pdf; Supplier: LCSC; Type: CAN收发器; Data Rate: 5Mbps; Voltage - Supply: 4.5V~5.5V; Current - Supply: 70mA; Operating Temperature: -40℃~+150℃
C11 = CC0402JRNPO9BN220: 容值:22pF;精度:±5%;额定电压:50V;材质(温度系数):NP0;; LCSC Part Name: 22pF ±5% 50V; Supplier Part: C106203; Manufacturer: YAGEO(国巨); Supplier Footprint: 0402; JLCPCB Part Class: Extended Part; Datasheet: https://atta.szlcsc.com/upload/public/pdf/source/20170505/1493957838062.pdf; Supplier: LCSC; Tolerance: ±5%; Voltage Rated: 50V; Temperature Coefficient: NP0
C13 = CGA0603X5R106K100JT: 容值:10uF;精度:±10%;额定电压:10V;温度系数:X5R;; LCSC Part Name: 10uF ±10% 10V; Supplier Part: C6119842; Manufacturer: HRE(芯声); Supplier Footprint: 0603; Supplier: LCSC; Tolerance: ±10%; Voltage Rating: 10V; Temperature Coefficient: X5R
C14 C61 = CGA0402X5R225K250GT: 容值:2.2uF;精度:±10%;额定电压:25V;温度系数:X5R;; LCSC Part Name: 2.2uF ±10% 25V; Supplier Part: C6119765; Manufacturer: HRE(芯声); Supplier Footprint: 0402; JLCPCB Part Class: Extended Part; Datasheet: https://atta.szlcsc.com/upload/public/pdf/source/20241113/42512B81E3F3992F62279BF469EB0759.pdf; Supplier: LCSC; Tolerance: ±10%; Voltage Rating: 25V; Temperature Coefficient: X5R
CN2 = WAFER-GH1.25-3PWB: 插针结构:1x3P;间距:1.25mm;安装方式:卧贴;参考系列:GH;总PIN数:3P;排数:1;每排PIN数:3;行距:-;额定电流:1A;触头材质:黄铜;触头镀层:-;工作温度范围:-25℃~+85℃;; LCSC Part Name: 1x3P 间距:1.25mm 卧贴 系列:GH; Supplier Part: C3029378; Manufacturer: XUNPU(讯普); Supplier Footprint: SMD,P=1.25mm,卧贴; JLCPCB Part Class: 扩展库; Datasheet: https://atta.szlcsc.com/upload/public/pdf/source/20220527/CB8773BFB0913C3B8ABD62CB38BA101A.pdf; Supplier: LCSC; Pins Structure: 1x3P; Pitch: 1.25mm; Mounting Type: 卧贴; Reference Series: GH; Number of Pins: 3P; Number of Rows: 1; Number of PINs Per Row: 3; Current Rating: 1A; Contact Material: 黄铜; Operating Temperature: -25℃~+85℃; Voltage Rating: 125V; Plastic Material: LCP; Supplementary Features: 辅助焊脚; Color: 米色; Z-Height of the Board: 4.35mm; X-Length of Bottom Edge on Board (Spacing Line): 7mm; Y-Width of Bottom Edge on Board: 5mm
D3 = SD103AWS_C7420360: 二极管配置:独立式;正向压降(Vf):370mV@20mA;直流反向耐压(Vr):40V;平均整流电流(Io):350mA;; LCSC Part Name: 电压:40V 电流:350mA; Supplier Part: C7420360; Manufacturer: 宏迦橙; Supplier Footprint: SOD-323; JLCPCB Part Class: 扩展库; Datasheet: https://atta.szlcsc.com/upload/public/pdf/source/20230828/EB98D42952FEC013AACB2F62A2475546.pdf; Supplier: LCSC; Diode Configuration: 独立式; Forward Voltage (Vf@If): 370mV@20mA; Reverse Voltage (Vr): 40V; Average Rectified Current (Io): 350mA; Reverse Leakage Current (Ir): 5uA@40V; Peak forward surge current: 1.5A
EXTRA_ADC = Test-Point: Test Point 测试点
LED3 = XL-3210SURUBC: 发光颜色:红色,蓝色;功率:80mW；55mW;正向电流:25mA;主波长:619nm~624nm；466nm~469nm;二极管配置:-;透镜颜色:无色透明透镜;色温:-;发光角度:120°;载带方式:侧贴;工作温度:-30℃~+85℃;; Supplier Part: C965881; Manufacturer: XINGLIGHT(成兴光); Supplier Footprint: SMD,1.5x3.2mm; JLCPCB Part Class: 扩展库; Datasheet: https://atta.szlcsc.com/upload/public/pdf/source/20221102/CA58C3F42CA0E2CC90CCF1FECEF5ED84.pdf; Supplier: LCSC; Emitted Color: 红色,蓝色; Power Dissipation: 80mW；55mW; Forward Current: 25mA; Dominant Wavelength: 619nm~624nm；466nm~469nm; Peak Wavelength: 624nm；472nm; Lens Color: 无色透明透镜; Viewing Angle: 120°; Mounting Sytle: 侧贴; Operating Temperature: -30℃~+85℃
R36-R39 = FRC0402J101 TS: 电阻类型:厚膜电阻;阻值:100Ω;精度:±5%;功率:62.5mW;最大工作电压:50V;温度系数:±100ppm/℃;; LCSC Part Name: 100Ω ±5% 62.5mW 厚膜电阻; Supplier Part: C2906884; Manufacturer: FOJAN(富捷); Supplier Footprint: 0402; JLCPCB Part Class: 扩展库; Datasheet: https://atta.szlcsc.com/upload/public/pdf/source/20211221/925EC7D7225764EE0046F22065062C87.pdf; Supplier: LCSC; Type: 厚膜电阻; Tolerance: ±5%; Power(Watts): 62.5mW; Overload Voltage (Max): 50V; Temperature Coefficient: ±100ppm/℃; Operating Temperature Range: -55℃~+155℃
R40 = AC0402FR-0710RL: 电阻类型:厚膜电阻;阻值:10Ω;精度:±1%;功率:62.5mW;最大工作电压:50V;温度系数:±200ppm/℃;; LCSC Part Name: 厚膜电阻 10Ω ±1% 62.5mW; Supplier Part: C144805; Manufacturer: YAGEO(国巨); Supplier Footprint: 0402; JLCPCB Part Class: Extended Part; Datasheet: https://atta.szlcsc.com/upload/public/pdf/source/20180927/C229861_4ABDC471507C1ED6AFB4BA66AFC8620A.pdf; Supplier: LCSC; Type: 厚膜电阻; Tolerance: ±1%; Power(Watts): 62.5mW; Overload Voltage (Max): 50V; Temperature Coefficient: ±200ppm/℃; Operating Temperature Range: -55℃~+155℃
RESET1 = TS-1088-AR02016: 电路结构:单刀单掷;按钮形状:圆形按钮;作用力:160gf;安装方式:立贴;开关长度:4mm;开关宽度:3mm;开关高度:2mm;带支架:不带;触点电流:50mA;额定电压(DC):12V;绝缘电阻:100MΩ;机械寿命:10万次;; LCSC Part Name: 4*3*2mm 立贴 轻触开关; Supplier Part: C720477; Manufacturer: XUNPU(讯普); Supplier Footprint: SMD; JLCPCB Part Class: Basic Part; Datasheet: https://atta.szlcsc.com/upload/public/pdf/source/20200810/C720475_60D09DD6C54279ADDB2DC25100F1CC11.pdf; Supplier: LCSC; Circuit: 单刀单掷; Actuator Style: 圆形按钮; Operating Force: 160gf; Mounting Style: 立贴; Switch Length: 4mm; Switch Width: 3mm; Switch Height: 2mm; Strike Gundam: 不带; Contact Current: 50mA; Voltage Rating (DC): 12V; Insulation Resistance: 100MΩ; Actuator/Cap Color: 黑色; Pin Style: SMD接片; Mechanical Life: 10万次; Operating Temperature: -30℃~+80℃
U2 = B0520X: 二极管配置:独立式;正向压降(Vf):600mV@500mA;直流反向耐压(Vr):20V;平均整流电流(Io):500mA;; LCSC Part Name: 电压:20V 电流:500mA; Supplier Part: C2910120; Manufacturer: CJ(江苏长电/长晶); Supplier Footprint: SOD-523; JLCPCB Part Class: 扩展库; Datasheet: https://atta.szlcsc.com/upload/public/pdf/source/20211111/1CE22EF1CCA0C0BB39A69FAB31AEFF6F.pdf; Supplier: LCSC; Diode Configuration: 独立式; Forward Voltage (Vf@If): 600mV@500mA; Reverse Voltage (Vr): 20V; Average Rectified Current (Io): 500mA; Reverse Leakage Current (Ir): 50uA@10V
U3 = KTH7801-X-N-SOP8: 16bit 高精度低延时霍尔角度编码器，SOP-8封装，可编程 4-4096 步/圈 ABZ 输出，PWM 14-bit 角度输出，工作电压兼容 3.3V 和 5V，工作温度-40°C ~125°C，符合 AEC-Q100 标准。; Supplier Part: C22459044; Manufacturer: CONNTEK(昆泰芯); Supplier Footprint: SOP-8; Datasheet: https://atta.szlcsc.com/upload/public/pdf/source/20240604/1736AA921F4EB8FFDAE5D62CF392F887.pdf; Supplier: LCSC
U19 = STM32H723VGH6: CPU内核:ARM-M系列;CPU最大主频:550MHz;应用领域:-;; LCSC Part Name: 高性能和带 DP-FPU 的 DSP、1 MByte 闪存的 Arm Cortex-M7 微控制器、564 Kbyte RAM、550 MHz CPU、L1 缓存、外部内存接口、外围设备子集; Supplier Part: C2848033; Manufacturer: ST(意法半导体); Supplier Footprint: TFBGA-100(8x8x0.8); JLCPCB Part Class: 扩展库; Datasheet: https://item.szlcsc.com/datasheet/STM32H723VGH6/3045688.html; Supplier: LCSC; CPU Core: ARM-M系列; CPU Maximum Speed: 550MHz; Program Storage Size: 1MB; Number of I/O: 80; ADC (Bit): 16bit；12bit; DAC (Bit): 12bit; Voltage - Supply: 1.62V~3.6V
U55-U58 = 星月型焊盘
U61 = WAFER-GH1.25-4PLB: 插针结构:1x4P;间距:1.25mm;安装方式:立贴;参考系列:GH;总PIN数:4P;排数:1;每排PIN数:4;行距:-;额定电流:1A;触头材质:黄铜;触头镀层:-;工作温度:-25℃~+85℃;; LCSC Part Name: 1x4P 间距:1.25mm 立贴 系列:GH; Supplier Part: C3029370; Manufacturer: XUNPU(讯普); Supplier Footprint: SMD,P=1.25mm; JLCPCB Part Class: 扩展库; Datasheet: https://item.szlcsc.com/datasheet/WAFER-GH1.25-4PLB/3561382.html; Supplier: LCSC; Pins Structure: 1x4P; Pitch: 1.25mm; Mounting Type: 立贴; Reference Series: GH; Number of Pins: 4P; Number of Rows: 1; Number of PINs Per Row: 4; Current Rating: 1A; Contact Material: 黄铜; Operating Temperature: -25℃~+85℃; Voltage Rating: 125V; Plastic Material: LCP; Supplementary Features: 辅助焊脚; Color: 米色; Z-Height of the Board: 4.2mm; X-Length of Bottom Edge on Board (Spacing Line): 8.25mm; Y-Width of Bottom Edge on Board: 4.95mm
X1 = TAXM8M4RDBCCT2T: 晶振类型:贴片晶振;频率:8MHz;常温频差:±10ppm;负载电容:10pF;频率稳定度:±15ppm;; LCSC Part Name: 8MHz ±10ppm 10pF; Supplier Part: C400090; Manufacturer: YJX(雅晶鑫); Supplier Footprint: SMD3225-4P; JLCPCB Part Class: Extended Part; Datasheet: https://atta.szlcsc.com/upload/public/pdf/source/20190626/C400090_CF95B89E745AFE4EF2E392EF8AC009D6.pdf; Supplier: LCSC; Type: 贴片晶振; Normal temperature Frequency Tolerance: ±10ppm; Load Capacitance: 10pF; Frequency Stability: ±15ppm; Equivalent Series Resistance(ESR): 250Ω; Operating Temperature: -40℃~+85℃; Crystal Type: 贴片晶振; External load capacitor: 10pF; Frequency Stability(Full temperature range): ±15ppm; Equivalent Series Resistance (ESR): 250Ω

## Nets
5V: C37.2 C53.2 C56.2 C132.2 C133.2 C178.2 C179.2 C181.2 C182.2 C183.1 C185.1 C187.2 C188.2 C195.2 C196.1 L3.2 R153.2 U16.2(IN) U52.2(IN) U54.2(IN) U59.8(VCC) U60.3(VCC) U64.2(IN) U64.5(NC) U66.8(VCC)
12V: C38.1 C39.1 C162.2 C163.2 C164.2 C165.2 C166.2 C167.2 C168.2 C169.2 C170.2 L1.2 R10.1 U12.10(VCC) U12.27(VCC) U12.37(Slug1)
GND: C1.1 C2.1 C3.1 C4.1 C5.1 C6.1 C9.1 C10.1 C11.1 C12.1 C13.1 C14.1 C24.2 C25.1 C37.1 C38.2 C39.2 C41.1 C45.1 C52.1 C53.1 C55.1 C56.1 C60.1 C61.2 C120.1 C132.1 C133.1 C141.1 C142.1 C143.1 C144.1 C145.1 C146.1 C147.1 C148.1 C149.1 C150.1 C151.1 C152.1 C153.1 C154.1 C155.1 C156.1 C157.1 C158.1 C159.1 C160.1 C161.1 C162.1 C163.1 C164.1 C165.1 C166.1 C167.1 C168.1 C169.1 C170.1 C171.1 C172.1 C173.1 C175.2 C176.1 C177.1 C178.1 C179.1 C180.1 C181.1 C182.1 C183.2 C185.2 C186.1 C187.1 C188.1 C190.2 C191.1 C192.2 C193.1 C194.2 C195.1 C196.2 CN2.3 D1.1(A) D16.1(A) D18.3(A) D20.1 D22.1(A) D23.1(A) LED3.2(B-) LED3.4(R-) POW.1(C) R1.2 R7.1 R8.1 R9.1 R143.1 R151.1 R152.1 R158.2 R170.2 R175.2 RESET1.1 U3.5(GND) U4.7(GND) U4.9(EPAD) U8.2 U10.2 U12.3(GNDA) U12.4(GNDA) U12.5(GNDA) U12.6(GNDA) U12.7(GNDA) U12.19(Multisense) U12.20(Multisense_EN) U12.22(SEL1) U12.30(GNDB) U12.31(GNDB) U12.32(GNDB) U12.33(GNDB) U12.34(GNDB) U14.5(GND) U16.1(GND) U19.C2(VSS) U19.E4(VSS) U19.E5(VSS) U19.E6(VSS) U19.G1(VSSA) U19.J1(VSS) U49.9(GND) U49.11(EP) U50.1 U51.1 U52.1(GND) U54.1(GND) U55.1 U56.1 U57.1 U58.1 U59.5(GND) U59.9(GND) U60.2(GND) U60.9(EP) U61.4 U64.1(GND) U66.4(VEE) U66.9(EP) X1.2 X1.4
VBAT: C1.2 U2.2(K) U19.B2(VBAT)
VCC3.3: C2.2 C3.2 C4.2 C5.2 C6.2 C12.2 C13.2 C177.2 C180.2 D3.2(A) D21.2(K) D24.2(K) R3.2 R17.2 R20.1 R21.1 R40.1 U2.1(A) U3.8(VDD) U19.D2(VDD) U19.F4(VDD) U19.F5(VDD) U19.F6(VDD33USB) U19.K1(VDD) U52.3(OUT) U54.3(OUT) U60.5(VIO)
A: L4.3 U8.4 U10.4
ADC1: C45.2 R33.2 U19.J3(PA6)
ADC3.3: C41.2 C52.2 C55.2 U14.8(VCC) U16.3(OUT)
ADC_IN10: C191.2 R171.2 U19.F2(PC1)
ADC_IN11: C193.2 R176.2 U19.F1(PC0)
B: L4.4 U8.3 U10.3
BATTERY: C24.1 C120.2 C141.2 C142.2 C143.2 C144.2 C145.2 C146.2 C147.2 C148.2 C149.2 C150.2 C151.2 C152.2 C153.2 C154.2 C155.2 C156.2 C157.2 C158.2 C159.2 C160.2 C161.2 C175.1 C176.2 D20.2 R6.2 R150.2 U4.2(VIN) U8.1 U10.1 U49.2(VIN) U50.2 U51.2
BOOT0: R1.1 U19.D5(BOOT0)
CANH-A: D18.1(K) L4.1 R18.2 R156.2 U59.7(B)
CANL-B: D18.2(K) L4.2 R18.1 R157.2 U59.6(A)
EXTRA_ADC: EXTRA_ADC.1 U19.G4(PC4)
EXTRA_ADC3.3: C186.2 C194.1 R177.2 R178.2 U64.3(OUT) U64.4(NC)
EXTRA_ADC_IN1: R168.1
EXTRA_ADC_IN2: R173.1
FDCAN1_RX: U19.B4(PB8) U60.4(RXD)
FDCAN1_TX: U19.A4(PB9) U60.1(TXD)
HSDA1: U12.2(DRAIN_LSDA) U12.8(DRAIN_LSDA) U12.9(DRAIN_LSDA) U12.11(SOURCE_HSDA) U12.12(SOURCE_HSDA) U12.13(SOURCE_HSDA) U12.14(SOURCE_HSDA) U12.38(Slug2)
HSDB1: U12.23(SOURCE_HSDB) U12.24(SOURCE_HSDB) U12.25(SOURCE_HSDB) U12.26(SOURCE_HSDB) U12.28(DRAIN_LSDB) U12.29(DRAIN_LSDB) U12.35(DRAIN_LSDB) U12.39(Slug3) U14.3(IP-) U14.4(IP-)
INA1: R23.1 U19.D4(PE0)
INB1: R26.2 U19.C4(PE1)
LED1: R4.1 U19.C3(PE4)
LED2: R5.1 U19.D3(PE5)
M_CMD_RX: RX.1(C) U19.K2(PA3) U59.1(RO)
M_CMD_TX: TX.1(C) U19.J2(PA2) U59.4(DI)
OSC_IN: C9.2 U19.C1(PH0-OSC_IN) X1.3
OSC_OUT: C11.2 U19.D1(PH1-OSC_OUT) X1.1
OUTB: U14.1(IP+) U14.2(IP+)
PWM2_CH1: R25.1 U19.H3(PA5)
PWM_CAP: U3.6(PWM) U19.C10(PA11)
RESET: C10.2 R3.1 RESET1.2 U19.E1(NRST)
SPI4_MISO: U3.4(MISO) U19.K6(PE13)
SPI4_MOSI: U3.2(MOSI) U19.G7(PE14)
SPI4_NSS: U3.3(CS) U19.H6(PE11)
SPI4_SCK: U3.7(SCLK) U19.J6(PE12)
SWDCLK: R39.1 U19.A9(PA14)
SWDIO: R38.1 U19.A10(PA13)
USART1_RX: R37.1 U19.G10(PB15)
USART1_TX: R36.1 U19.H10(PB14)
USART2_DE: U19.H2(PA1) U59.2(RE#) U59.3(DE)
V_BUS: D3.1(K) U61.1
$1N1609: LED3.1(B+) R4.2
$1N5066: LED3.3(R+) R5.2
$1N12483: CN2.2 R36.2
$1N12668: R38.2 U61.2
$1N20786: C60.2 R40.2 U19.H1(VDDA)
$1N20952: C61.1 U19.F8(VCAP)
$1N21004: C14.2 U19.E7(VCAP)
$1N22551: CN2.1 R37.2
$1N28774: R39.2 U61.3
$2N2387: C15.1 U4.1(BOOT)
$2N2389: C25.2 U4.6(SS)
$2N2390: R7.2 U4.4(RT/SYNC)
$2N2393: R6.1 R8.2 U4.3(EN)
$2N2394: C15.2 D1.2(K) L1.1 U4.8(SW)
$2N2395: R9.2 R10.2 U4.5(FB)
$2N3213: R20.2 TX.2(A)
$2N3214: R21.2 RX.2(A)
$2N5580: POW.2(A) R17.1
$2N34835: R152.2 R153.1 U49.7(FB)
$2N34837: C173.2 R144.2 U49.8(COMP)
$2N34840: C174.1 D16.2(K) L3.1 U49.10(SW)
$2N34841: C174.2 U49.1(BOOT)
$2N34843: R143.2 U49.5(RT/CLK)
$2N34845: C171.2 U49.4(SS/TR)
$2N34847: R150.1 R151.2 U49.3(EN)
$2N34852: C172.2 R144.1
$2N54905: R157.1 U60.6(CANL)
$2N54907: R156.1 U60.7(CANH)
$2N55158: R158.1 U60.8(S)
$3N829: R25.2 U12.17(PWM)
$3N830: R23.2 U12.16(INA)
$3N833: R26.1 U12.21(INB)
$3N5525: R33.1 U14.7(OUT)
$4N1428: R167.1 R168.2 U66.2(INA-)
$4N1443: D23.2(K) D24.1(A) R167.2 R171.1 U66.1(OUTA)
$4N1585: C190.1 R170.1 R178.1 U66.3(INA+)
$4N2183: R172.1 R173.2 U66.6(INB-)
$4N2188: D21.1(A) D22.2(K) R172.2 R176.1 U66.7(OUTB)
$4N2197: C192.1 R175.1 R177.1 U66.5(INB+)

Not connected (* = marked no-connect by the designer): CN2 4 5; U3 1(TEST)*; U12 1(NC)* 15(SEL0)* 18(NC)* 36(NC)*; U14 6(VZCR)*; U16 4(NC)* 5(NC)*; U19 A1(PC14-OSC32_IN)* A2(PC13)* A3(PE2)* A5(PB7)* A6(PB4)* A7(PB3)* A8(PA15)* B1(PC15-OSC32_OUT)* B3(PE3)* B5(PB6)* B6(PD5)* B7(PD2)* B8(PC11)* B9(PC10)* B10(PA12)* C5(PB5)* C6(PD6)* C7(PD3)* C8(PC12)* C9(PA9)* D6(PD7)* D7(PD4)* D8(PD0)* D9(PA8)* D10(PA10)* E2(PC2_C)* E3(PE6)* E8(PD1)* E9(PC9)* E10(PC7)* F3(PC3_C)* F7(PDR_ON)* F9(PC8)* F10(PC6)* G2(PA0)* G3(PA4)* G5(PB2)* G6(PE10)* G8(PD15)* G9(PD11)* H4(PC5)* H5(PE7)* H7(PE15)* H8(PD14)* H9(PD10)* J4(PB0)* J5(PE8)* J7(PB10)* J8(PB13)* J9(PD9)* J10(PD13)* K3(PA7)* K4(PB1)* K5(PE9)* K7(PB11)* K8(PB12)* K9(PD8)* K10(PD12)*; U49 6(PWRGD)*; U52 4(NC)* 5(NC)*; U54 4(NC)* 5(NC)*; U61 5* 6*

## Notes on the sheets
sheet 2
- NC
sheet 3
- Current sampling circuit with 3.3 V power supplied
sheet 4
- -10V~+10V converted to 0V ~ 3.3V
